# Altium project AtlasRevA.PrjPcb
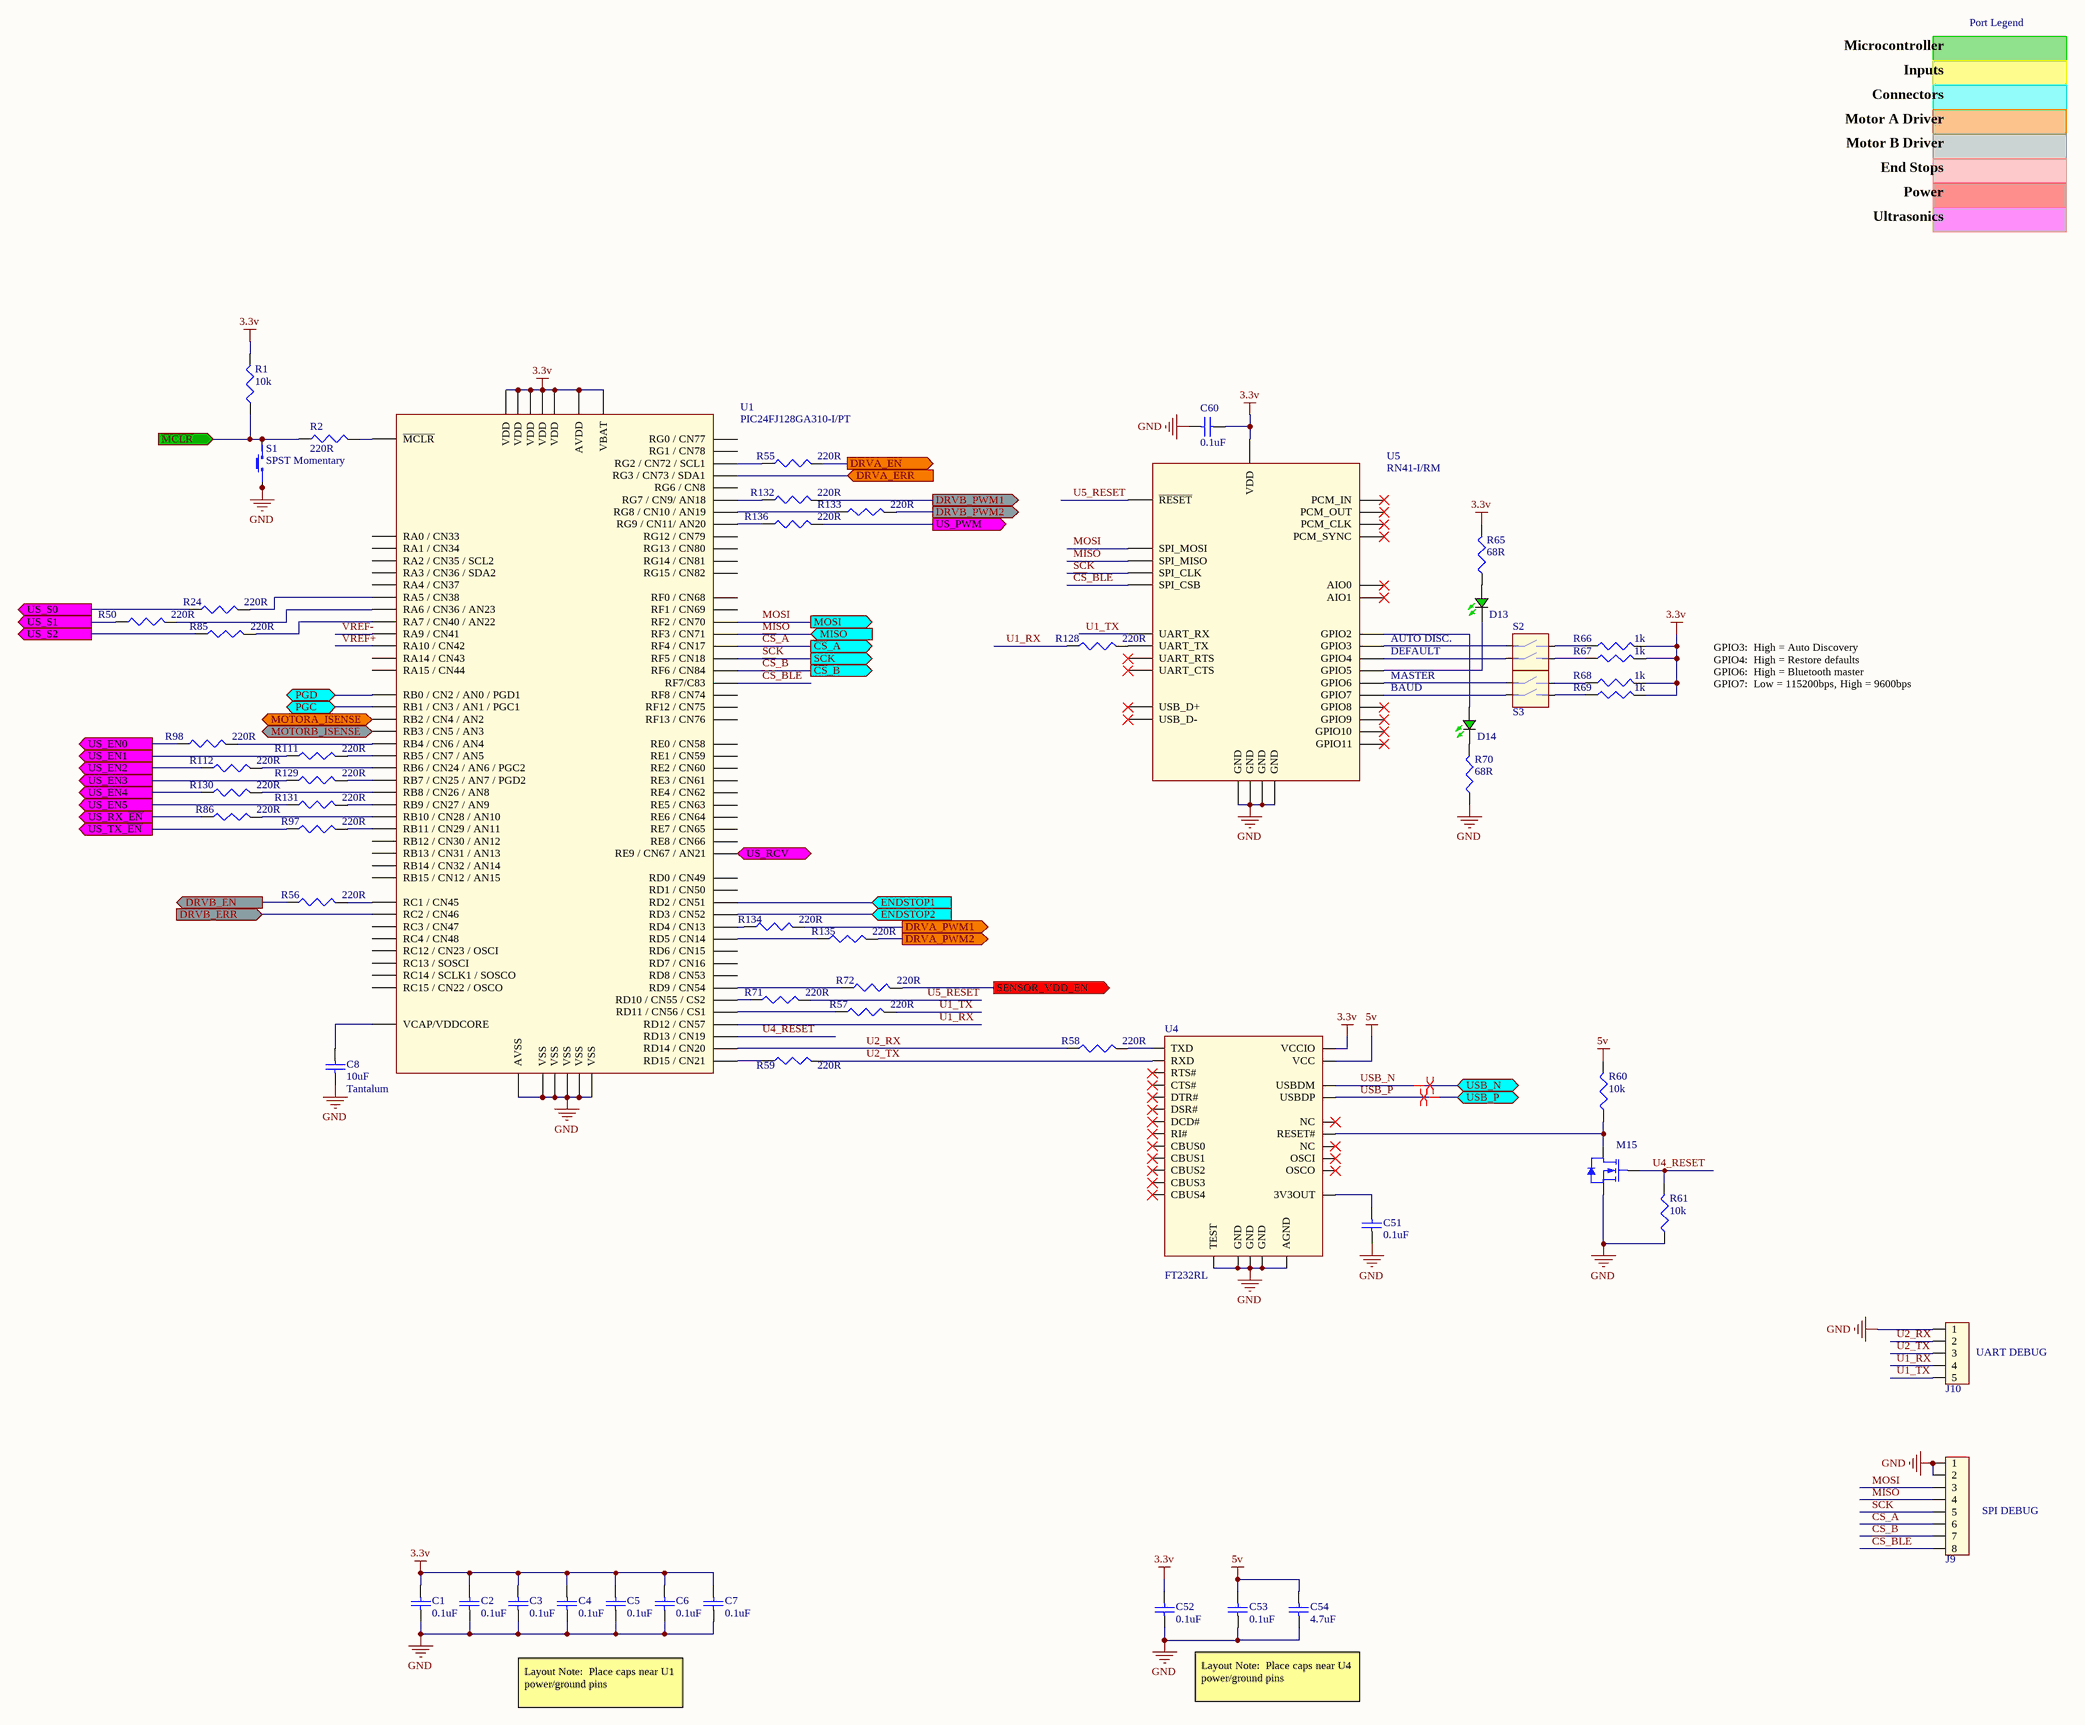
[diagram p0: Microcontroller.SchDoc]
8 sheets, 319 parts. Net scope: flat (ports and power ports of the same name join across sheets).
Board file: AtlasRevA.PcbDoc
Sheets:
  Microcontroller.SchDoc
  Motor A Driver.SchDoc
  Motor B Driver.SchDoc
  Connectors.SchDoc
  End Stops.SchDoc
  Power.SchDoc
  Ultrasonics.SchDoc
  Project Overview.SchDoc

## Sheet Microcontroller.SchDoc
size C; DrawnBy: Ross Harvey; Revision: A; SheetNumber: 1

### Parts
C1  0.1uF  [CAP0603W]
C2  0.1uF  [CAP0603W]
C3  0.1uF  [CAP0603W]
C4  0.1uF  [CAP0603W]
C5  0.1uF  [CAP0603W]
C6  0.1uF  [CAP0603W]
C7  0.1uF  [CAP0603W]
C8  Type: Tantalum  [CAP1206W]  (hidden comment: 10uF)
C51  0.1uF  [CAP0603W]
C52  0.1uF  [CAP0603W]
C53  0.1uF  [CAP0603W]
C54  4.7uF  [CAP1206W]
C60  0.1uF  [CAP0603W]
D13  LTST-S270KGKT  [LED Green 0603]  (value not drawn)
D14  LTST-S270KGKT  [LED Green 0603]  (value not drawn)
J9  1x8 Header  [1x8 Header]  (value not drawn)
J10  1x5 Header  [1x5 Header]  (value not drawn)
M15  2N7002P,215  [SOT23-3M]  (value not drawn)
R1  10k  [RES0603W]
R2  220R  [RES0603W]
R24  220R  [RES0603W]
R50  220R  [RES0603W]
R55  220R  [RES0603W]
R56  220R  [RES0603W]
R57  220R  [RES0603W]
R58  220R  [RES0603W]
R59  220R  [RES0603W]
R60  10k  [RES0603W]
R61  10k  [RES0603W]
R65  68R  [RES0603W]
R66  1k  [RES0603W]
R67  1k  [RES0603W]
R68  1k  [RES0603W]
R69  1k  [RES0603W]
R70  68R  [RES0603W]
R71  220R  [RES0603W]
R72  220R  [RES0603W]
R85  220R  [RES0603W]
R86  220R  [RES0603W]
R97  220R  [RES0603W]
R98  220R  [RES0603W]
R111  220R  [RES0603W]
R112  220R  [RES0603W]
R128  220R  [RES0603W]
R129  220R  [RES0603W]
R130  220R  [RES0603W]
R131  220R  [RES0603W]
R132  220R  [RES0603W]
R133  220R  [RES0603W]
R134  220R  [RES0603W]
R135  220R  [RES0603W]
R136  220R  [RES0603W]
S1  SPST Momentary  [TECONN_1571563]
S2  SPST  [CTS_219-2MST]  (value not drawn)
S3  SPST  [CTS_219-2MST]  (value not drawn)
U1  PIC24FJ128GA310-I/PT  [TQFP100 0.4mm Pitch]
U4  FT232RL  [SSOP-28]
U5  RN41-I/RM  [RN41]

### Ports
DRVA_EN (out), DRVA_ERR (in), DRVA_PWM1 (out), DRVA_PWM2 (out), DRVB_EN (out), DRVB_ERR (in), DRVB_PWM1 (out), DRVB_PWM2 (out), ENDSTOP1 (in), ENDSTOP2 (in), MISO (in), MOSI (out), MOTORA_ISENSE (in), MOTORB_ISENSE (in), PGC (bidir), PGD (bidir), SCK (out), SENSOR_VDD_EN (out), US_EN0 (out), US_EN1 (out), US_EN2 (out), US_EN3 (out), US_EN4 (out), US_EN5 (out), US_PWM (out), US_RCV (in), US_RX_~{EN} (out), US_S0 (out), US_S1 (out), US_S2 (out), US_TX_~{EN} (out), USB_N (bidir), USB_P (bidir), ~{CS}_A (out), ~{CS}_B (out), ~{MCLR} (in)

### Nets
3.3v: C1.1 C2.1 C3.1 C4.1 C5.1 C6.1 C7.1 C52.1 C60.2 R1.2 R65.2 R66.2 R67.2 R68.2 R69.2 U1.2(VDD) U1.16(VDD) U1.30(AVDD) U1.37(VDD) U1.46(VDD) U1.62(VDD) U1.86(VBAT) U4.4(VCCIO) U5.11(VDD)
5v: C53.1 C54.1 R60.2 U4.20(VCC)
GND: C1.2 C2.2 C3.2 C4.2 C5.2 C6.2 C7.2 C8.2 C51.2 C52.2 C53.2 C54.2 C60.1 J9.1 J9.2 J10.1 M15.2(SOURCE) R61.1 R70.1 S1.1 S1.2 U1.15(VSS) U1.31(AVSS) U1.36(VSS) U1.45(VSS) U1.65(VSS) U1.75(VSS) U4.7(GND) U4.18(GND) U4.21(GND) U4.25(AGND) U4.26(TEST) U5.1(GND) U5.12(GND) U5.28(GND) U5.29(GND)
~{CS}_A: J9.6 U1.49(RF4_/_CN17) ; port ~{CS}_A
~{CS}_B: J9.7 U1.55(RF6_/_CN84) ; port ~{CS}_B
~{CS}_BLE: J9.8 U1.54(RF7/C83) U5.23(SPI_CSB)
DRVA_EN: R55.2 ; port DRVA_EN
DRVB_EN: R56.1 ; port DRVB_EN
MISO: J9.4 U1.51(RF3_/_CN71) U5.24(SPI_MISO) ; port MISO
MOSI: J9.3 U1.52(RF2_/_CN70) U5.2(SPI_MOSI) ; port MOSI
SCK: J9.5 U1.50(RF5_/_CN18) U5.6(SPI_CLK) ; port SCK
U1_RX: J10.4 R128.1 U1.79(RD12_/_CN57)
U1_TX: J10.5 R57.2 U5.13(UART_RX)
U2_RX: J10.2 R58.1 U1.47(RD14_/_CN20)
U2_TX: J10.3 R59.2 U4.5(RXD)
U4_RESET: M15.1(GATE) R61.2 U1.80(RD13_/_CN19)
U5_RESET: R71.2 U5.5(~{RESET})
US_S0: R24.1 ; port US_S0
US_S1: R50.1 ; port US_S1
US_S2: R85.1 ; port US_S2
USB_N: U4.16(USBDM) ; port USB_N
USB_P: U4.15(USBDP) ; port USB_P
VREF+: U1.29(RA10_/_CN42)
VREF-: U1.28(RA9_/_CN41)
NetC8_1: C8.1 U1.85(VCAP/VDDCORE)
NetC51_1: C51.1 U4.17(3V3OUT)
NetC56_1: U1.23(RB2_/_CN4_/_AN2) ; port MOTORA_ISENSE
NetC58_1: U1.22(RB3_/_CN5_/_AN3) ; port MOTORB_ISENSE
NetC90_1: U1.77(RD2_/_CN51) ; port ENDSTOP1
NetC92_1: U1.78(RD3_/_CN52) ; port ENDSTOP2
NetD13_1: D13.1(K) U5.21(GPIO5)
NetD13_2: D13.2(A) R65.1
NetD14_1: D14.1(K) R70.2
NetD14_2: D14.2(A) U5.19(GPIO2)
NetJ2_1: R1.1 R2.1 S1.3 S1.4 ; port ~{MCLR}
NetJ2_4: U1.25(RB0_/_CN2_/_AN0_/_PGD1) ; port PGD
NetJ2_5: U1.24(RB1_/_CN3_/_AN1_/_PGC1) ; port PGC
NetM6_3: U1.56(RG3_/_CN73_/_SDA1) ; port DRVA_ERR
NetM13_3: U1.7(RC2_/_CN46) ; port DRVB_ERR
NetM15_3: M15.3(SOURCE) R60.1 U4.19(RESET#)
NetR2_2: R2.2 U1.13(~{MCLR})
NetR24_2: R24.2 U1.61(RA5_/_CN38)
NetR50_2: R50.2 U1.91(RA6_/_CN36_/_AN23)
NetR55_1: R55.1 U1.57(RG2_/_CN72_/_SCL1)
NetR56_2: R56.2 U1.6(RC1_/_CN45)
NetR57_1: R57.1 U1.71(RD11_/_CN56_/_CS1)
NetR58_2: R58.2 U4.1(TXD)
NetR59_1: R59.1 U1.48(RD15_/_CN21)
NetR66_1: R66.1 S2.2
NetR67_1: R67.1 S2.4
NetR68_1: R68.1 S3.2
NetR69_1: R69.1 S3.4
NetR71_1: R71.1 U1.70(RD10_/_CN55_/_CS2)
NetR72_1: R72.1 U1.69(RD9_/_CN54)
NetR72_2: R72.2 ; port SENSOR_VDD_EN
NetR85_2: R85.2 U1.92(RA7_/_CN40_/_AN22)
NetR86_1: R86.1 ; port US_RX_~{EN}
NetR86_2: R86.2 U1.34(RB10_/_CN28_/_AN10)
NetR97_1: R97.1 ; port US_TX_~{EN}
NetR97_2: R97.2 U1.35(RB11_/_CN29_/_AN11)
NetR98_1: R98.1 ; port US_EN0
NetR98_2: R98.2 U1.21(RB4_/_CN6_/_AN4)
NetR111_1: R111.1 ; port US_EN1
NetR111_2: R111.2 U1.20(RB5_/_CN7_/_AN5)
NetR112_1: R112.1 ; port US_EN2
NetR112_2: R112.2 U1.26(RB6_/_CN24_/_AN6_/_PGC2)
NetR128_2: R128.2 U5.14(UART_TX)
NetR129_1: R129.1 ; port US_EN3
NetR129_2: R129.2 U1.27(RB7_/_CN25_/_AN7_/_PGD2)
NetR130_1: R130.1 ; port US_EN4
NetR130_2: R130.2 U1.32(RB8_/_CN26_/_AN8)
NetR131_1: R131.1 ; port US_EN5
NetR131_2: R131.2 U1.33(RB9_/_CN27_/_AN9)
NetR132_1: R132.1 U1.11(RG7_/_CN9/_AN18)
NetR132_2: R132.2 ; port DRVB_PWM1
NetR133_1: R133.1 U1.12(RG8_/_CN10_/_AN19)
NetR133_2: R133.2 ; port DRVB_PWM2
NetR134_1: R134.1 U1.81(RD4_/_CN13)
NetR134_2: R134.2 ; port DRVA_PWM1
NetR135_1: R135.1 U1.82(RD5_/_CN14)
NetR135_2: R135.2 ; port DRVA_PWM2
NetR136_1: R136.1 U1.14(RG9_/_CN11/_AN20)
NetR136_2: R136.2 ; port US_PWM
NetS2_1: S2.1 U5.20(GPIO3)
NetS2_3: S2.3 U5.22(GPIO4)
NetS3_1: S3.1 U5.3(GPIO6)
NetS3_3: S3.3 U5.4(GPIO7)
NetU1_19: U1.19(RE9_/_CN67_/_AN21) ; port US_RCV

Not connected (* = marked no-connect by the designer): U1 1(RG15_/_CN82) 3(RE5_/_CN63) 4(RE6_/_CN64) 5(RE7_/_CN65) 8(RC3_/_CN47) 9(RC4_/_CN48) 10(RG6_/_CN8) 17(RA0_/_CN33) 18(RE8_/_CN66) 38(RA1_/_CN34) 39(RF13_/_CN76) 40(RF12_/_CN75) 41(RB12_/_CN30_/_AN12) 42(RB13_/_CN31_/_AN13) 43(RB14_/_CN32_/_AN14) 44(RB15_/_CN12_/_AN15) 53(RF8_/_CN74) 58(RA2_/_CN35_/_SCL2) 59(RA3_/_CN36_/_SDA2) 60(RA4_/_CN37) 63(RC12_/_CN23_/_OSCI) 64(RC15_/_CN22_/_OSCO) 66(RA14_/_CN43) 67(RA15_/_CN44) 68(RD8_/_CN53) 72(RD0_/_CN49) 73(RC13_/_SOSCI) 74(RC14_/_SCLK1_/_SOSCO) 76(RD1_/_CN50) 83(RD6_/_CN15) 84(RD7_/_CN16) 87(RF0_/_CN68) 88(RF1_/_CN69) 89(RG1_/_CN78) 90(RG0_/_CN77) 93(RE0_/_CN58) 94(RE1_/_CN59) 95(RG14_/_CN81) 96(RG12_/_CN79) 97(RG13_/_CN80) 98(RE2_/_CN60) 99(RE3_/_CN61) 100(RE4_/_CN62); U4 2(DTR#)* 3(RTS#)* 6(RI#)* 8(NC)* 9(DSR#)* 10(DCD#)* 11(CTS#)* 12(CBUS4)* 13(CBUS2)* 14(CBUS3)* 22(CBUS1)* 23(CBUS0)* 24(NC)* 27(OSCI)* 28(OSCO)*; U5 7(PCM_CLK)* 8(PCM_SYNC)* 9(PCM_IN)* 10(PCM_OUT)* 15(UART_RTS)* 16(UART_CTS)* 17(USB_D+)* 18(USB_D-)* 30(AIO0)* 31(GPIO8)* 32(GPIO9)* 33(GPIO10)* 34(GPIO11)* 35(AIO1)*

### Layout directives
differential pair: USB_N, USB_P

### Notes on the sheet
- Port Legend
- Microcontroller
- Inputs
- Connectors
- Motor A Driver
- Motor B Driver
- End Stops
- Power
- Ultrasonics
- AUTO DISC.
- (near U5) DEFAULT
- (near U5) BAUD
- (near U5) MASTER
- GPIO3:  High = Auto Discovery
  GPIO4:  High = Restore defaults
  GPIO6:  High = Bluetooth master
  GPIO7:  Low = 115200bps, High = 9600bps
- (near J10) UART DEBUG
- (near J9) SPI DEBUG
- Layout Note:  Place caps near U4 power/ground pins
- Layout Note:  Place caps near U1 power/ground pins

### Library data of the parts
C1-C7 C51-C53 C60 = 0.1uF: MFG1_PN: VJ0603Y104JXJPW1BC; MFG1: Vishay; Value: 0.1uF
C8 = 10uF Tantalum: MFG1_PN: 293D106X96R3A2TE3; MFG1: Vishay; Value: 10uF
C54 = 4.7uF: MFG1_PN: VJ1206V475ZXJTW1BC; MFG1: Vishay; Voltage: 16v; Value: 4.7uF
D13 D14 = LED Green 0603: MFG: Lite On; VFORWARD: 2v; CURRENT: 20mA; COLOR: Green; MFG_PN: LTST-S270KGKT
J9 = 1x8 Header: 1x8 Header, 2.52mm pitch
J10 = 1x5 Header: 1x5 Header, 2.52mm pitch
M15 = 2N7002: NFET_SINGLE_360mA_60V; LOAD: NL; MFG: NXP; VDS_MAX: 60v; I_MAX: 360mA; VGS_MAX: 20v; P_MAX: *; RDS_ON: *; MFG_PN: 2N7002P,215
R1 R60 R61 = 10K (0603): Tolerance: 1%; POWER: 0.1W; MFG_PN: CRCW060310K0FKEA; MFG: Vishay; Load: NL; Value: 10k
R2 R24 R50 R55-R59 R71 R72 R85 R86 R97 R98 R111 R112 R128-R136 = 220R (0603): Tolerance: 1%; POWER: 0.1W; MFG_PN: CRCW0603220RFKEB; MFG: Vishay; Load: NL; Value: 220R
R65 R70 = 68R (0603): Tolerance: 1%; POWER: 0.1W; MFG_PN: CRCW060368R0FKEB; MFG: Vishay; Load: NL; Value: 68R
R66-R69 = 1k (0603): Tolerance: 1%; POWER: 0.1W; MFG_PN: CRCW06031K00FKEA; MFG: Vishay; Load: NL; Value: 1k
S1 = SPST Momentary: SPST Momentary Switch; MFG: TE Connectivity; MFG_PN: 1571563-1; TYPE: SPST Momentary
S2 S3 = 2xSPST Microswitch: SPST Microswitch Array (2 Switches); MFG: CTS; MFG_PN: 219-2MST; TYPE: SPST
U1 = PIC24FJ128GA310: MFG: Microchip; MFG_PN: PIC24FJ128GA310-I/PT
U4 = FT232RL: UART Interface/Bridge; MFG: FTDI; MFG_PN: FT232RL
U5 = RN41: 2.4GHz Class 1 Bluetooth Module; MFG: MICROCHIP; MFG_PN: RN41-I/RM

## Sheet Motor A Driver.SchDoc
size C; DrawnBy: Ross Harvey; Revision: A; SheetNumber: 2; ModifiedDate: 7/2/2015
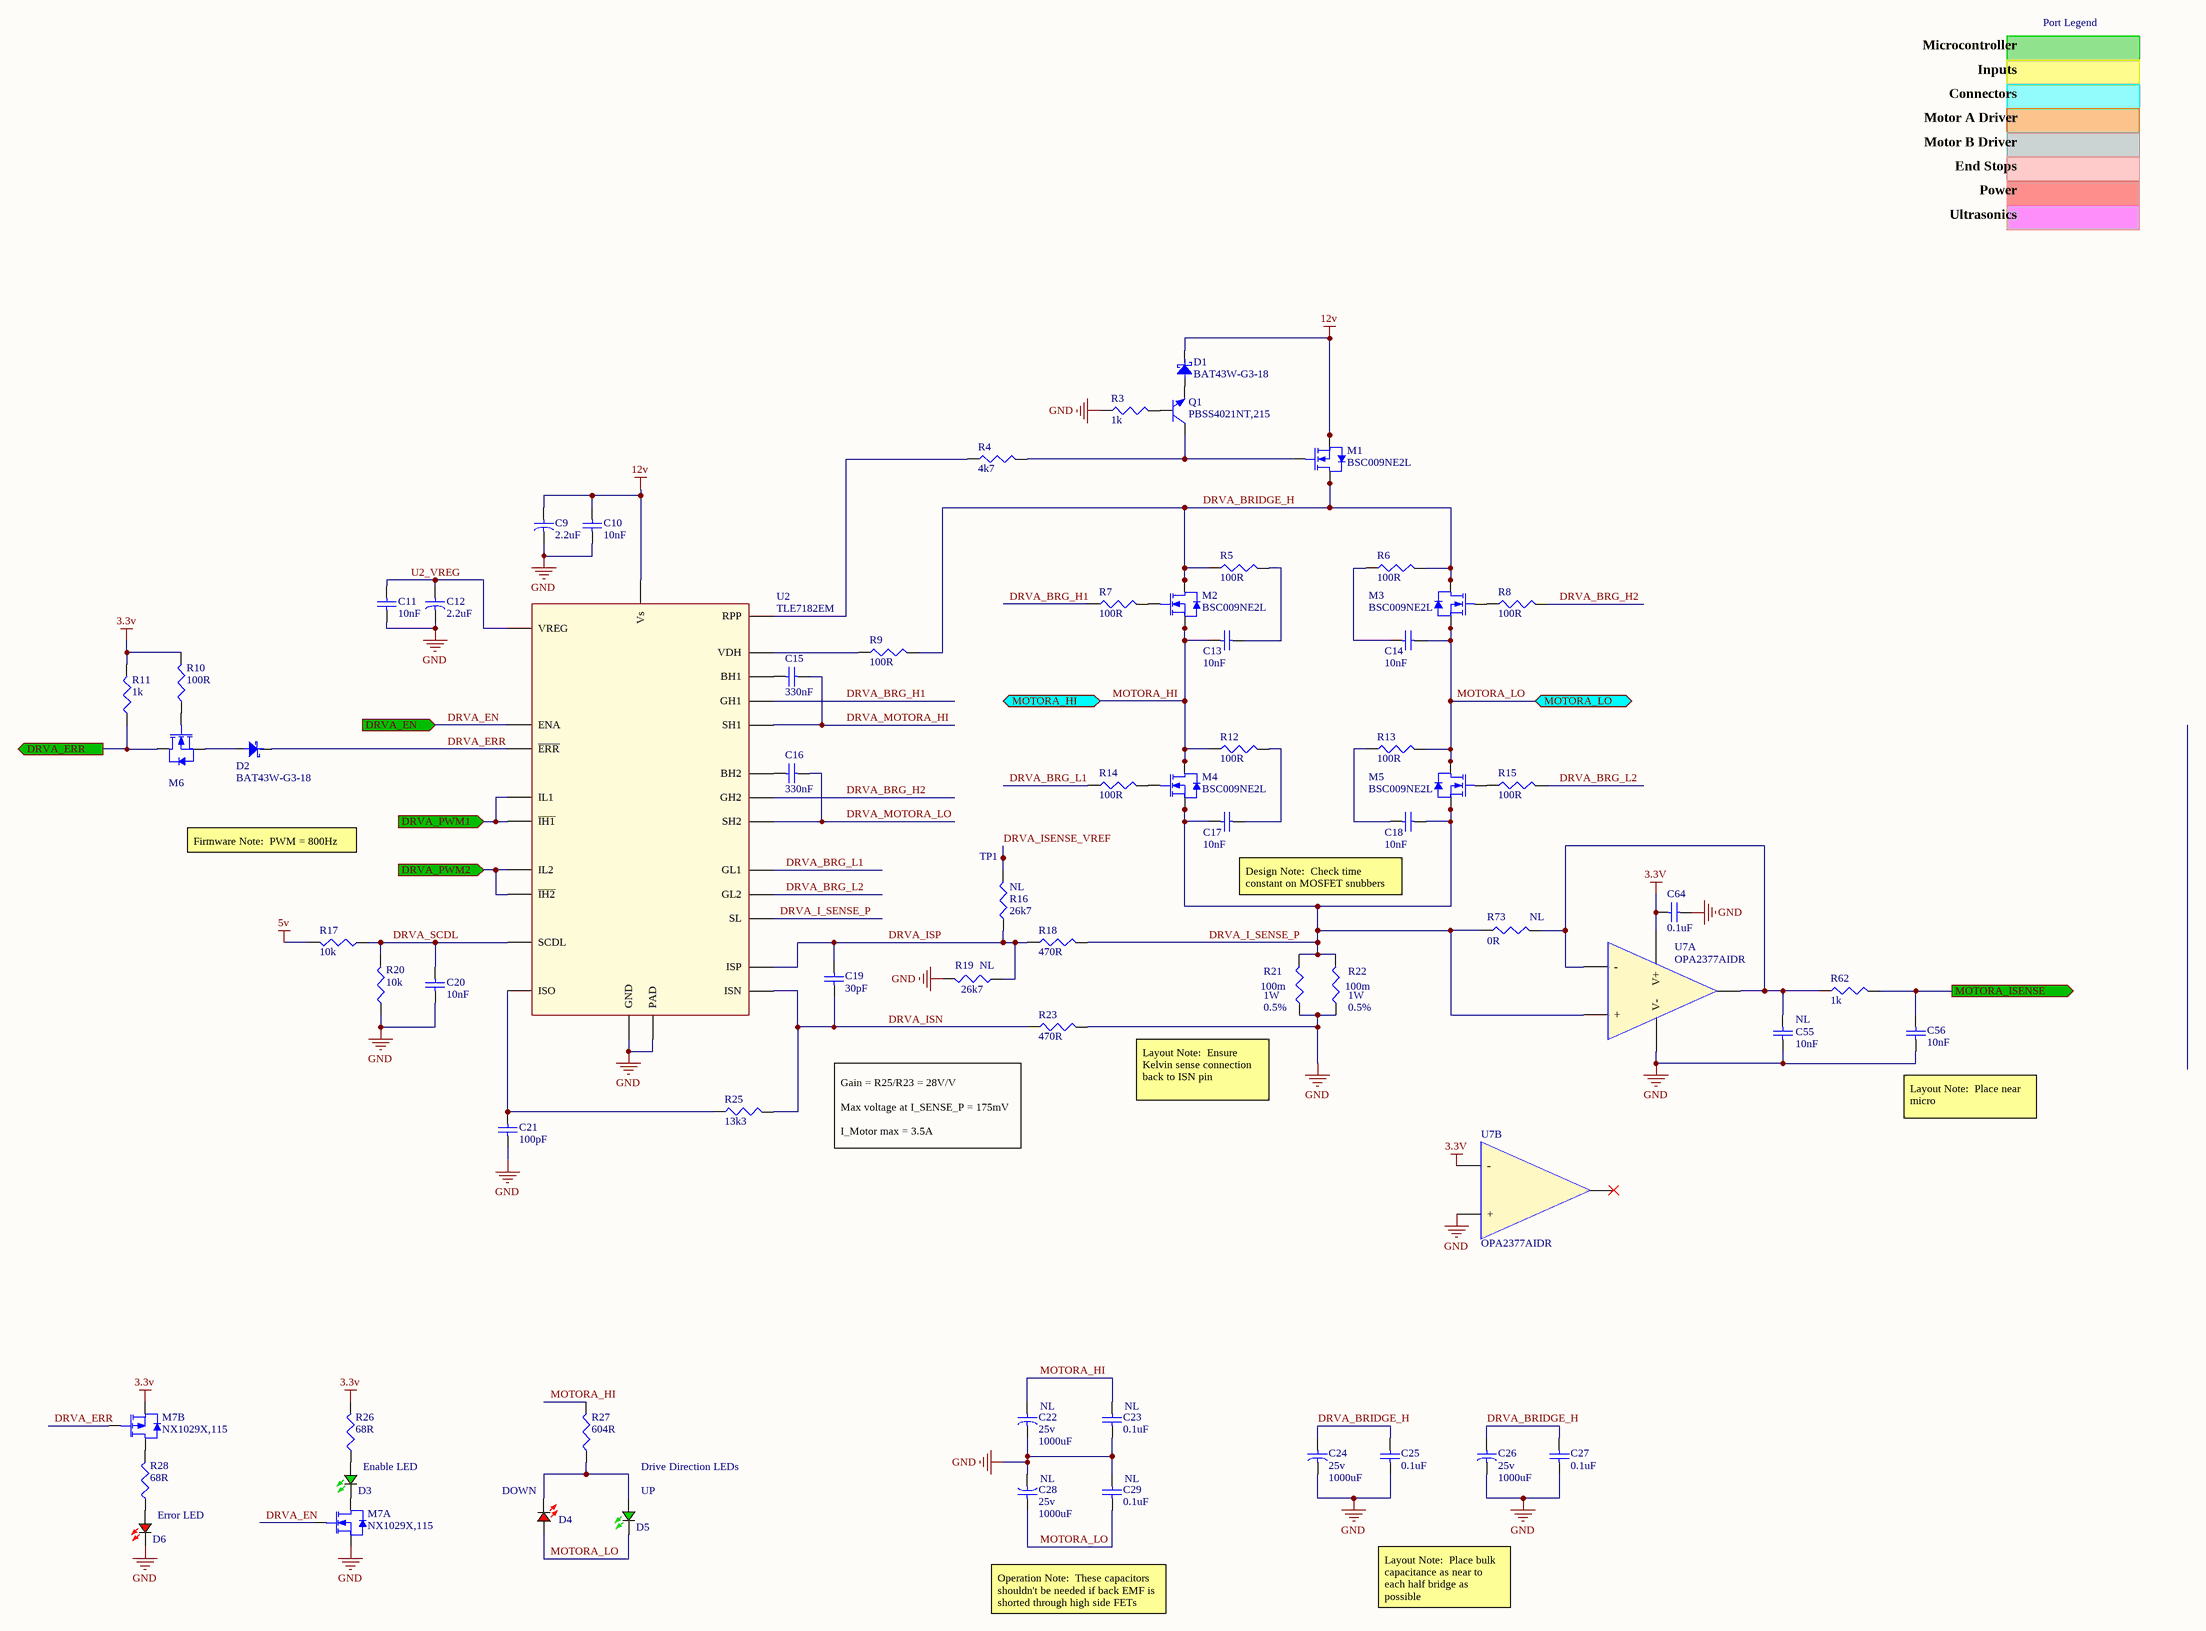
[diagram p1: Motor A Driver.SchDoc]

### Parts
C9  2.2uF  [SMD Elec Cap (5.5_5.4_4)]
C10  10nF  [CAP0603W]
C11  10nF  [CAP0603W]
C12  2.2uF  [SMD Elec Cap (5.5_5.4_4)]
C13  10nF  [CAP0603W]
C14  10nF  [CAP0603W]
C15  330nF  [CAP0805W]
C16  330nF  [CAP0805W]
C17  10nF  [CAP0603W]
C18  10nF  [CAP0603W]
C19  30pF  [CAP0603W]
C20  10nF  [CAP0603W]
C21  100pF  [CAP0603W]
C22  Voltage: 25v  LOAD: NL  [SMD Elec Cap (13.5_15_12.5)]  (hidden comment: 1000uF)
C23  LOAD: NL  [CAP0603W]  (hidden comment: 0.1uF)
C24  Voltage: 25v  [SMD Elec Cap (13.5_15_12.5)]  (hidden comment: 1000uF)
C25  0.1uF  [CAP0603W]
C26  Voltage: 25v  [SMD Elec Cap (13.5_15_12.5)]  (hidden comment: 1000uF)
C27  0.1uF  [CAP0603W]
C28  Voltage: 25v  LOAD: NL  [SMD Elec Cap (13.5_15_12.5)]  (hidden comment: 1000uF)
C29  LOAD: NL  [CAP0603W]  (hidden comment: 0.1uF)
C55  LOAD: NL  [CAP0603W]  (hidden comment: 10nF)
C56  10nF  [CAP0603W]
C64  0.1uF  [CAP0603W]
D1  BAT43W-G3-18  [SOD-123]
D2  BAT43W-G3-18  [SOD-123]
D3  LTST-S270KGKT  [LED Green 0603]  (value not drawn)
D4  VLMS1300-GS08  [LED Red 0603]  (value not drawn)
D5  LTST-S270KGKT  [LED Green 0603]  (value not drawn)
D6  VLMS1300-GS08  [LED Red 0603]  (value not drawn)
M1  BSC009NE2L  [PowerPAK-SO8]
M2  BSC009NE2L  [PowerPAK-SO8]
M3  BSC009NE2L  [PowerPAK-SO8]
M4  BSC009NE2L  [PowerPAK-SO8]
M5  BSC009NE2L  [PowerPAK-SO8]
M6  2N7002P,215  [SOT23-3M]  (value not drawn)
M7  NX1029X,115  [SOT666-6N]  (parts A,B of 2)
Q1  PBSS4021NT,215  [SOT23-3M]
R3  1k  [RES0603W]
R4  4k7  [RES0603W]
R5  100R  [RES0603W]
R6  100R  [RES0603W]
R7  100R  [RES0603W]
R8  100R  [RES0603W]
R9  100R  [RES0603W]
R10  100R  [RES0603W]
R11  1k  [RES0603W]
R12  100R  [RES0603W]
R13  100R  [RES0603W]
R14  100R  [RES0603W]
R15  100R  [RES0603W]
R16  Load: NL  [RES0603W]  (hidden comment: 26k7)
R17  10k  [RES0603W]
R18  470R  [RES0603W]
R19  Load: NL  [RES0603W]  (hidden comment: 26k7)
R20  10k  [RES0603W]
R21  POWER: 1W  Tolerance: 0.5%  [RES2512W]  (hidden comment: 100m)
R22  POWER: 1W  Tolerance: 0.5%  [RES2512W]  (hidden comment: 100m)
R23  470R  [RES0603W]
R25  13k3  [RES0603W]
R26  68R  [RES0603W]
R27  604R  [RES1206W]
R28  68R  [RES0603W]
R62  1k  [RES0603W]
R73  Load: NL  [RES0603W]  (hidden comment: 0R)
TP1  TP  [1mm Via]  (value not drawn)
U2  TLE7182EM  [PG-SSOP24]
U7  OPA2377AIDR  [SOIC-8]  (parts A,B of 2)

### Ports
DRVA_EN (in), DRVA_ERR (out), DRVA_PWM1 (in), DRVA_PWM2 (in), MOTORA_HI (bidir), MOTORA_ISENSE (out), MOTORA_LO (bidir)

### Nets
3.3v: C64.1 M7.4(S2) R10.2 R11.2 R26.2 U7.6(-) U7.8(V+)
5v: R17.2
12v: C9.2 C10.1 D1.1(K) M1.1(SOURCE) M1.2(SOURCE) M1.3(SOURCE) U2.7(Vs)
GND: C9.1 C10.2 C11.2 C12.1 C20.2 C21.2 C22.1 C23.2 C24.1 C25.2 C26.1 C27.2 C28.1 C29.1 C55.2 C56.2 C64.2 D6.1(K) M7.1(S1) R3.1 R19.2 R20.1 R21.1 R22.1 R23.2 U2.19(GND) U2.25(PAD) U7.4(V-) U7.5(+)
DRVA_BRG_H1: R7.1 U2.23(GH1)
DRVA_BRG_H2: R8.2 U2.2(GH2)
DRVA_BRG_L1: R14.1 U2.21(GL1)
DRVA_BRG_L2: R15.2 U2.4(GL2)
DRVA_BRIDGE_H: C24.2 C25.1 C26.2 C27.1 M1.5(DRAIN) M1.6(DRAIN) M1.7(DRAIN) M1.8(DRAIN) M2.5(DRAIN) M2.6(DRAIN) M2.7(DRAIN) M2.8(DRAIN) M3.5(DRAIN) M3.6(DRAIN) M3.7(DRAIN) M3.8(DRAIN) R5.1 R6.2 R9.2
DRVA_EN: M7.2(G1) U2.9(ENA) ; port DRVA_EN
DRVA_ERR: D2.1(K) M7.5(G2) U2.17(~{ERR})
DRVA_I_SENSE_P: C17.1 C18.2 M4.1(SOURCE) M4.2(SOURCE) M4.3(SOURCE) M5.1(SOURCE) M5.2(SOURCE) M5.3(SOURCE) R18.2 R21.2 R22.2 R73.1 U2.20(SL) U7.3(+)
DRVA_ISENSE_VREF: R16.2 TP1.1
DRVA_ISN: C19.2 R23.1 R25.2 U2.10(ISN)
DRVA_ISP: C19.1 R16.1 R18.1 R19.1 U2.11(ISP)
DRVA_MOTORA_HI: C15.2 U2.22(SH1)
DRVA_MOTORA_LO: C16.2 U2.3(SH2)
DRVA_SCDL: C20.1 R17.1 R20.2 U2.18(SCDL)
MOTORA_HI: C13.1 C22.2 C23.1 M2.1(SOURCE) M2.2(SOURCE) M2.3(SOURCE) M4.5(DRAIN) M4.6(DRAIN) M4.7(DRAIN) M4.8(DRAIN) R12.1 R27.2 ; port MOTORA_HI
MOTORA_LO: C14.2 C28.2 C29.2 D4.2(A) D5.1(K) M3.1(SOURCE) M3.2(SOURCE) M3.3(SOURCE) M5.5(DRAIN) M5.6(DRAIN) M5.7(DRAIN) M5.8(DRAIN) R13.2 ; port MOTORA_LO
U2_VREG: C11.1 C12.2 U2.8(VREG)
NetC13_2: C13.2 R5.2
NetC14_1: C14.1 R6.1
NetC15_1: C15.1 U2.24(BH1)
NetC16_1: C16.1 U2.1(BH2)
NetC17_2: C17.2 R12.2
NetC18_1: C18.1 R13.1
NetC21_1: C21.1 R25.1 U2.12(ISO)
NetC55_1: C55.1 R62.1 R73.2 U7.1(OUTA) U7.2(-)
NetC56_1: C56.1 R62.2 ; port MOTORA_ISENSE
NetD1_2: D1.2(A) Q1.2(C)
NetD2_2: D2.2(A) M6.2(SOURCE)
NetD3_1: D3.1(K) M7.6(D1)
NetD3_2: D3.2(A) R26.1
NetD4_1: D4.1(K) D5.2(A) R27.1
NetD6_2: D6.2(A) R28.1
NetM1_4: M1.4(GATE) Q1.3(E) R4.2
NetM2_4: M2.4(GATE) R7.2
NetM3_4: M3.4(GATE) R8.1
NetM4_4: M4.4(GATE) R14.2
NetM5_4: M5.4(GATE) R15.1
NetM6_1: M6.1(GATE) R10.1
NetM6_3: M6.3(SOURCE) R11.1 ; port DRVA_ERR
NetM7_3: M7.3(D2) R28.2
NetQ1_1: Q1.1(B) R3.2
NetR4_1: R4.1 U2.6(RPP)
NetR9_1: R9.1 U2.5(VDH)
NetR134_2: U2.15(~{IH1}) U2.16(IL1) ; port DRVA_PWM1
NetR135_2: U2.13(~{IH2}) U2.14(IL2) ; port DRVA_PWM2

Not connected (* = marked no-connect by the designer): U7 7(OUTB)*

### Notes on the sheet
- Microcontroller
- Port Legend
- Inputs
- Connectors
- Motor A Driver
- Motor B Driver
- End Stops
- Power
- Ultrasonics
- Firmware Note:  PWM = 800Hz
- Design Note:  Check time constant on MOSFET snubbers
- (near R23) Gain = R25/R23 = 28V/V
  Max voltage at I_SENSE_P = 175mV
  I_Motor max = 3.5A
- Layout Note:  Ensure Kelvin sense connection back to ISN pin
- (near C56) Layout Note:  Place near micro
- Enable LED
- (near D4) DOWN
- Drive Direction LEDs
- (near D5) UP
- Error LED
- Operation Note:  These capacitors shouldn't be needed if back EMF is shorted through high side FETs
- Layout Note:  Place bulk capacitance as near to each half bridge as possible

### Library data of the parts
C9 C12 = 2.2uF/35v: Tolerance: 20%; MFG1_PN: EEE-FC1V2R2AR; MFG1: PANASONIC; Voltage: 35v; Value: 2.2uF
C10 C11 C13 C14 C17 C18 C20 C55 C56 = 10nF: MFG1_PN: VJ0603Y103KXAAC; MFG1: Vishay; Value: 10nF
C15 C16 = 330nF: MFG1_PN: VJ0805V334ZXAPW1BC; MFG1: Vishay; Voltage: 50v; Value: 330nF
C19 = 30pF: MFG1_PN: VJ0805A300JXBAT; MFG1: Vishay; Value: 30pF
C21 = 100pF: MFG1_PN: VJ0603A101JNAAO; MFG1: Vishay; Voltage: 50v; Value: 100pF
C22 C24 C26 C28 = 1000uF 25v: Tolerance: 20%; MFG1_PN: EEV-FK1E102Q; MFG1: PANASONIC; Value: 1000uF
C23 C25 C27 C29 C64 = 0.1uF: as C1 on sheet Microcontroller; Value: 0.1uF
D1 D2 = BAT43: MFG: Vishay; Value: *; MFG_PN: BAT43W-G3-18
D3 D5 = LED Green 0603: as D13 on sheet Microcontroller; MFG_PN: LTST-S270KGKT
D4 D6 = LED Red 0603: MFG: Vishay; VFORWARD: 2V; CURRENT: 20mA; COLOR: Red; MFG_PN: VLMS1300-GS08
M1-M5 = BSC009NE2L: NFET_SINGLE_100A_25v; LOAD: NL; MFG: INFINEON; VDS_MAX: 25v; I_MAX: 100A; VGS_MAX: 16; P_MAX: 74W; RDS_ON: 1.25m; MFG_PN: BSC009NE2LS5ATMA1
M6 = 2N7002: as M15 on sheet Microcontroller; P_MAX: *; RDS_ON: *; MFG_PN: 2N7002P,215
M7 = NX1029X: Complementary P/NFET; MFG: NXP; VDS_P: -50v; VDS_N: 60v; VGS: 20v; ID_P: -170mA; ID_N: 330mA; MFG_PN: NX1029X,115
Q1 = PBSS4021NT: NPN_SINGLE_8A_20v; MFG: NXP; VCE_MAX: 20v; IMAX: 8A; LOAD: NL; MFG_PN: PBSS4021NT,215
R3 R11 R62 = 1k (0603): as R66 on sheet Microcontroller; Value: 1k
R4 = 4k7 (0603): Tolerance: 1%; POWER: 0.1W; MFG_PN: CRCW06034K70FKEA; MFG: Vishay; Load: NL; Value: 4k7
R5-R10 R12-R15 = 100R (0603): Tolerance: 1%; POWER: 0.1W; MFG_PN: CRCW0603100RFKEA; MFG: Vishay; Load: NL; Value: 100R
R16 R19 = 26k7 (0603): Tolerance: 1%; POWER: 0.1W; MFG_PN: CRCW060326K7FKEA; MFG: Vishay; Value: 26k7
R17 R20 = 10K (0603): as R1 on sheet Microcontroller; Value: 10k
R18 R23 = 470R (0603): Tolerance: 1%; POWER: 0.1W; MFG_PN: CRCW0603470RFKEA; MFG: Vishay; Load: NL; Value: 470R
R21 R22 = 100mR 0.5% (2512): MFG_PN: WSL2512R1000DEA; MFG: Vishay; Load: NL; Value: 100m
R25 = 13k3 (0603): Tolerance: 1%; POWER: 0.1W; MFG_PN: CRCW060313K3FKEA; MFG: Vishay; Load: NL; Value: 13k3
R26 R28 = 68R (0603): as R65 on sheet Microcontroller; Value: 68R
R27 = 604R (1206): POWER: 0.5W; MFG_PN: CRCW1206604RFKEAHP; MFG: VISHAY; Load: NL; Tolerance: 1%; Value: 604R
R73 = 0R (0603): MFG_PN: CRCW12060000Z0EA; MFG: Vishay; Value: 0R
TP1 = Testpoint - Via 1mm
U2 = TLE7182: Full Bridge Gate Driver; MFG: INFINEON; LOAD: NL; MFG_PN: TLE7182EM
U7 = OPA2377AIDR: OpAmp - 2 Channel; LOAD: NL; MFG: TI; CHANNELS: 2; GBP: 5MHz; SINGLE_SUPPLY: TRUE; VMAX: 5.5v; OFFSET_VOLTAGE: 1mV; MFG_PN: OPA2377AIDR

## Sheet Motor B Driver.SchDoc
size C; DrawnBy: Ross Harvey; Revision: A; SheetNumber: 3; DocumentName: Motor B Driver; ModifiedDate: 7/2/2105; ProjectName: Atlas
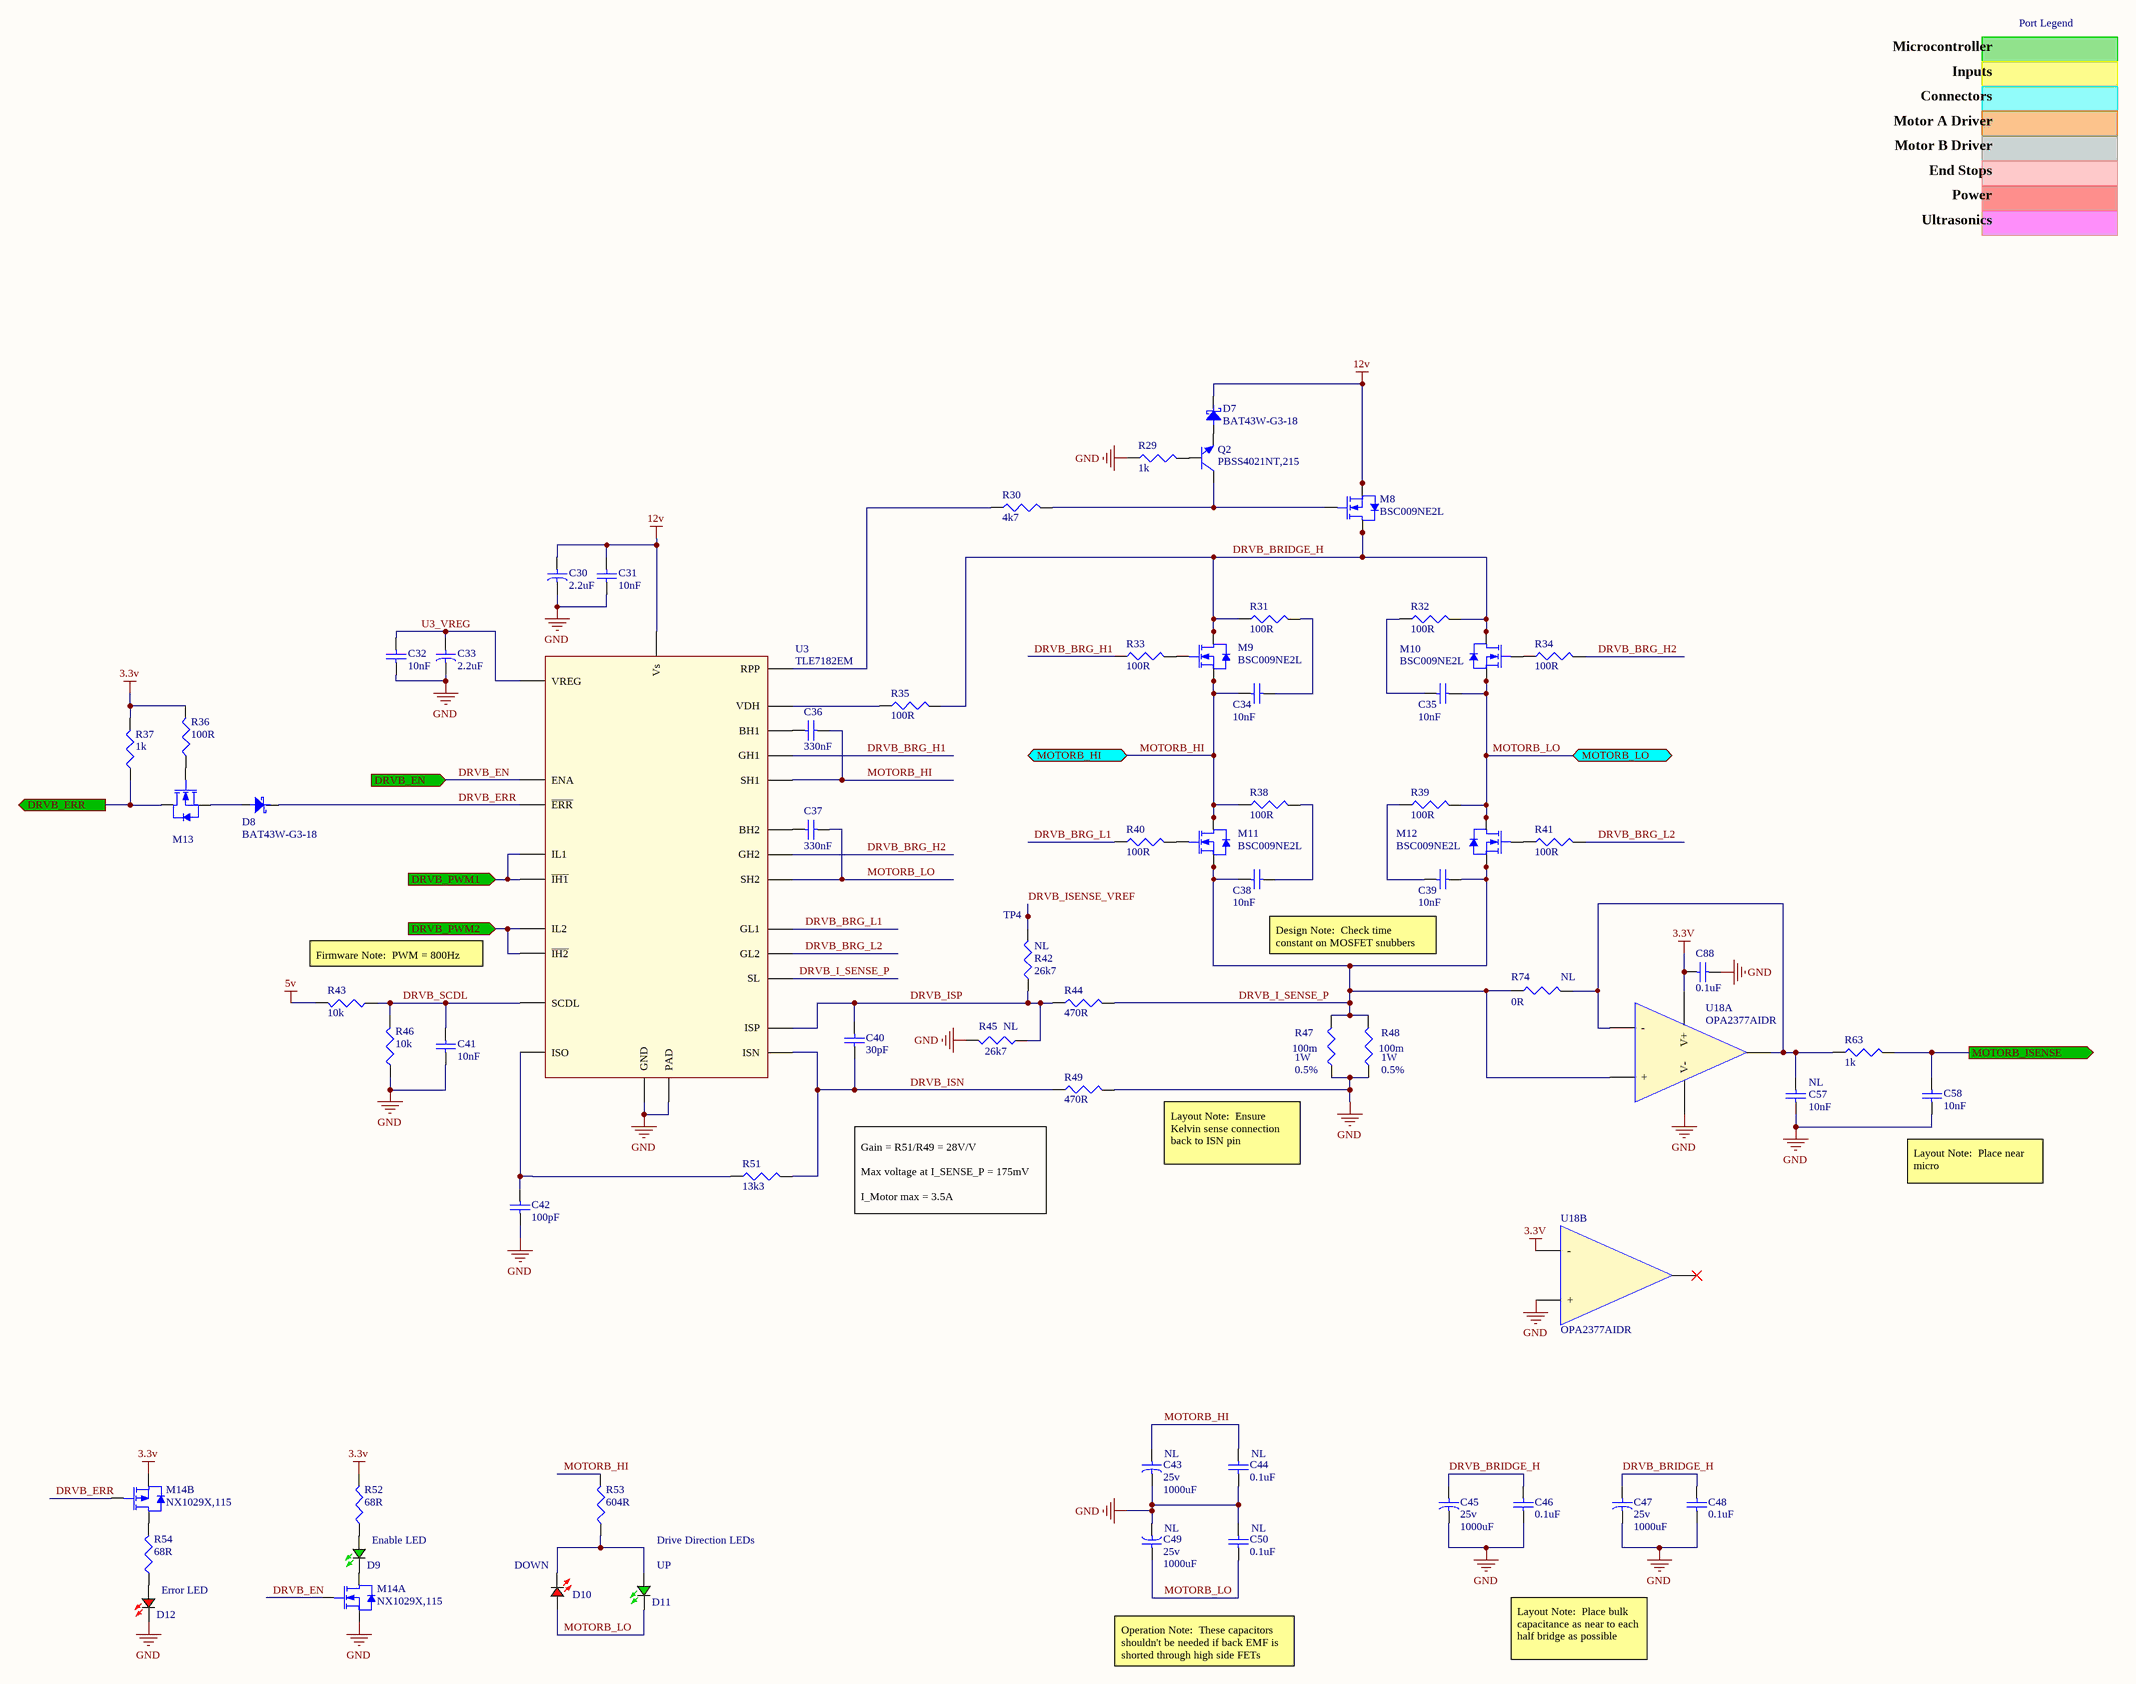
[diagram p2: Motor B Driver.SchDoc]

### Parts
C30  2.2uF  [SMD Elec Cap (5.5_5.4_4)]
C31  10nF  [CAP0603W]
C32  10nF  [CAP0603W]
C33  2.2uF  [SMD Elec Cap (5.5_5.4_4)]
C34  10nF  [CAP0603W]
C35  10nF  [CAP0603W]
C36  330nF  [CAP0805W]
C37  330nF  [CAP0805W]
C38  10nF  [CAP0603W]
C39  10nF  [CAP0603W]
C40  30pF  [CAP0603W]
C41  10nF  [CAP0603W]
C42  100pF  [CAP0603W]
C43  Voltage: 25v  LOAD: NL  [SMD Elec Cap (13.5_15_12.5)]  (hidden comment: 1000uF)
C44  LOAD: NL  [CAP0603W]  (hidden comment: 0.1uF)
C45  Voltage: 25v  [SMD Elec Cap (13.5_15_12.5)]  (hidden comment: 1000uF)
C46  0.1uF  [CAP0603W]
C47  Voltage: 25v  [SMD Elec Cap (13.5_15_12.5)]  (hidden comment: 1000uF)
C48  0.1uF  [CAP0603W]
C49  Voltage: 25v  LOAD: NL  [SMD Elec Cap (13.5_15_12.5)]  (hidden comment: 1000uF)
C50  LOAD: NL  [CAP0603W]  (hidden comment: 0.1uF)
C57  LOAD: NL  [CAP0603W]  (hidden comment: 10nF)
C58  10nF  [CAP0603W]
C88  0.1uF  [CAP0603W]
D7  BAT43W-G3-18  [SOD-123]
D8  BAT43W-G3-18  [SOD-123]
D9  LTST-S270KGKT  [LED Green 0603]  (value not drawn)
D10  VLMS1300-GS08  [LED Red 0603]  (value not drawn)
D11  LTST-S270KGKT  [LED Green 0603]  (value not drawn)
D12  VLMS1300-GS08  [LED Red 0603]  (value not drawn)
M8  BSC009NE2L  [PowerPAK-SO8]
M9  BSC009NE2L  [PowerPAK-SO8]
M10  BSC009NE2L  [PowerPAK-SO8]
M11  BSC009NE2L  [PowerPAK-SO8]
M12  BSC009NE2L  [PowerPAK-SO8]
M13  2N7002P,215  [SOT23-3M]  (value not drawn)
M14  NX1029X,115  [SOT666-6N]  (parts A,B of 2)
Q2  PBSS4021NT,215  [SOT23-3M]
R29  1k  [RES0603W]
R30  4k7  [RES0603W]
R31  100R  [RES0603W]
R32  100R  [RES0603W]
R33  100R  [RES0603W]
R34  100R  [RES0603W]
R35  100R  [RES0603W]
R36  100R  [RES0603W]
R37  1k  [RES0603W]
R38  100R  [RES0603W]
R39  100R  [RES0603W]
R40  100R  [RES0603W]
R41  100R  [RES0603W]
R42  Load: NL  [RES0603W]  (hidden comment: 26k7)
R43  10k  [RES0603W]
R44  470R  [RES0603W]
R45  Load: NL  [RES0603W]  (hidden comment: 26k7)
R46  10k  [RES0603W]
R47  POWER: 1W  Tolerance: 0.5%  [RES2512W]  (hidden comment: 100m)
R48  POWER: 1W  Tolerance: 0.5%  [RES2512W]  (hidden comment: 100m)
R49  470R  [RES0603W]
R51  13k3  [RES0603W]
R52  68R  [RES0603W]
R53  604R  [RES1206W]
R54  68R  [RES0603W]
R63  1k  [RES0603W]
R74  Load: NL  [RES0603W]  (hidden comment: 0R)
TP4  TP  [1mm Via]  (value not drawn)
U3  TLE7182EM  [PG-SSOP24]
U18  OPA2377AIDR  [SOIC-8]  (parts A,B of 2)

### Ports
DRVB_EN (in), DRVB_ERR (out), DRVB_PWM1 (in), DRVB_PWM2 (in), MOTORB_HI (bidir), MOTORB_ISENSE (out), MOTORB_LO (bidir)

### Nets
3.3v: C88.1 M14.4(S2) R36.2 R37.2 R52.2 U18.6(-) U18.8(V+)
5v: R43.2
12v: C30.2 C31.1 D7.1(K) M8.1(SOURCE) M8.2(SOURCE) M8.3(SOURCE) U3.7(Vs)
GND: C30.1 C31.2 C32.2 C33.1 C41.2 C42.2 C43.1 C44.2 C45.1 C46.2 C47.1 C48.2 C49.1 C50.1 C57.2 C58.2 C88.2 D12.1(K) M14.1(S1) R29.1 R45.2 R46.1 R47.1 R48.1 R49.2 U3.19(GND) U3.25(PAD) U18.4(V-) U18.5(+)
DRVB_BRG_H1: R33.1 U3.23(GH1)
DRVB_BRG_H2: R34.2 U3.2(GH2)
DRVB_BRG_L1: R40.1 U3.21(GL1)
DRVB_BRG_L2: R41.2 U3.4(GL2)
DRVB_BRIDGE_H: C45.2 C46.1 C47.2 C48.1 M8.5(DRAIN) M8.6(DRAIN) M8.7(DRAIN) M8.8(DRAIN) M9.5(DRAIN) M9.6(DRAIN) M9.7(DRAIN) M9.8(DRAIN) M10.5(DRAIN) M10.6(DRAIN) M10.7(DRAIN) M10.8(DRAIN) R31.1 R32.2 R35.2
DRVB_EN: M14.2(G1) U3.9(ENA) ; port DRVB_EN
DRVB_ERR: D8.1(K) M14.5(G2) U3.17(~{ERR})
DRVB_I_SENSE_P: C38.1 C39.2 M11.1(SOURCE) M11.2(SOURCE) M11.3(SOURCE) M12.1(SOURCE) M12.2(SOURCE) M12.3(SOURCE) R44.2 R47.2 R48.2 R74.1 U3.20(SL) U18.3(+)
DRVB_ISENSE_VREF: R42.2 TP4.1
DRVB_ISN: C40.2 R49.1 R51.2 U3.10(ISN)
DRVB_ISP: C40.1 R42.1 R44.1 R45.1 U3.11(ISP)
DRVB_SCDL: C41.1 R43.1 R46.2 U3.18(SCDL)
MOTORB_HI: C34.1 C36.2 C43.2 C44.1 M9.1(SOURCE) M9.2(SOURCE) M9.3(SOURCE) M11.5(DRAIN) M11.6(DRAIN) M11.7(DRAIN) M11.8(DRAIN) R38.1 R53.2 U3.22(SH1) ; port MOTORB_HI
MOTORB_LO: C35.2 C37.2 C49.2 C50.2 D10.2(A) D11.1(K) M10.1(SOURCE) M10.2(SOURCE) M10.3(SOURCE) M12.5(DRAIN) M12.6(DRAIN) M12.7(DRAIN) M12.8(DRAIN) R39.2 U3.3(SH2) ; port MOTORB_LO
U3_VREG: C32.1 C33.2 U3.8(VREG)
NetC34_2: C34.2 R31.2
NetC35_1: C35.1 R32.1
NetC36_1: C36.1 U3.24(BH1)
NetC37_1: C37.1 U3.1(BH2)
NetC38_2: C38.2 R38.2
NetC39_1: C39.1 R39.1
NetC42_1: C42.1 R51.1 U3.12(ISO)
NetC57_1: C57.1 R63.1 R74.2 U18.1(OUTA) U18.2(-)
NetC58_1: C58.1 R63.2 ; port MOTORB_ISENSE
NetD7_2: D7.2(A) Q2.2(C)
NetD8_2: D8.2(A) M13.2(SOURCE)
NetD9_1: D9.1(K) M14.6(D1)
NetD9_2: D9.2(A) R52.1
NetD10_1: D10.1(K) D11.2(A) R53.1
NetD12_2: D12.2(A) R54.1
NetM8_4: M8.4(GATE) Q2.3(E) R30.2
NetM9_4: M9.4(GATE) R33.2
NetM10_4: M10.4(GATE) R34.1
NetM11_4: M11.4(GATE) R40.2
NetM12_4: M12.4(GATE) R41.1
NetM13_1: M13.1(GATE) R36.1
NetM13_3: M13.3(SOURCE) R37.1 ; port DRVB_ERR
NetM14_3: M14.3(D2) R54.2
NetQ2_1: Q2.1(B) R29.2
NetR30_1: R30.1 U3.6(RPP)
NetR35_1: R35.1 U3.5(VDH)
NetR132_2: U3.15(~{IH1}) U3.16(IL1) ; port DRVB_PWM1
NetR133_2: U3.13(~{IH2}) U3.14(IL2) ; port DRVB_PWM2

Not connected (* = marked no-connect by the designer): U18 7(OUTB)*

### Notes on the sheet
- Port Legend
- Microcontroller
- Inputs
- Connectors
- Motor A Driver
- Motor B Driver
- End Stops
- Power
- Ultrasonics
- (near R43) Firmware Note:  PWM = 800Hz
- Design Note:  Check time constant on MOSFET snubbers
- Layout Note:  Ensure Kelvin sense connection back to ISN pin
- (near R49) Gain = R51/R49 = 28V/V
  Max voltage at I_SENSE_P = 175mV
  I_Motor max = 3.5A
- (near C58) Layout Note:  Place near micro
- Error LED
- Enable LED
- (near D10) DOWN
- Drive Direction LEDs
- (near D11) UP
- Layout Note:  Place bulk capacitance as near to each half bridge as possible
- Operation Note:  These capacitors shouldn't be needed if back EMF is shorted through high side FETs

### Library data of the parts
C30 C33 = 2.2uF/35v: as C9 on sheet Motor A Driver; Value: 2.2uF
C31 C32 C34 C35 C38 C39 C41 C57 C58 = 10nF: MFG1_PN: VJ0603Y103KXAAC; MFG1: Vishay; Value: 10nF
C36 C37 = 330nF: as C15 on sheet Motor A Driver; Value: 330nF
C40 = 30pF: MFG1_PN: VJ0805A300JXBAT; MFG1: Vishay; Value: 30pF
C42 = 100pF: as C21 on sheet Motor A Driver; Value: 100pF
C43 C45 C47 C49 = 1000uF 25v: as C22 on sheet Motor A Driver; Value: 1000uF
C44 C46 C48 C50 C88 = 0.1uF: as C1 on sheet Microcontroller; Value: 0.1uF
D7 D8 = BAT43: MFG: Vishay; Value: *; MFG_PN: BAT43W-G3-18
D9 D11 = LED Green 0603: as D13 on sheet Microcontroller; MFG_PN: LTST-S270KGKT
D10 D12 = LED Red 0603: as D4 on sheet Motor A Driver; MFG_PN: VLMS1300-GS08
M8-M12 = BSC009NE2L: as M1 on sheet Motor A Driver
M13 = 2N7002: as M15 on sheet Microcontroller; P_MAX: *; RDS_ON: *; MFG_PN: 2N7002P,215
M14 = NX1029X: as M7 on sheet Motor A Driver; MFG_PN: NX1029X,115
Q2 = PBSS4021NT: as Q1 on sheet Motor A Driver; MFG_PN: PBSS4021NT,215
R29 R37 R63 = 1k (0603): as R66 on sheet Microcontroller; Value: 1k
R30 = 4k7 (0603): as R4 on sheet Motor A Driver; Value: 4k7
R31-R36 R38-R41 = 100R (0603): as R5 on sheet Motor A Driver; Value: 100R
R42 R45 = 26k7 (0603): as R16 on sheet Motor A Driver; Value: 26k7
R43 R46 = 10K (0603): as R1 on sheet Microcontroller; Value: 10k
R44 R49 = 470R (0603): as R18 on sheet Motor A Driver; Value: 470R
R47 R48 = 100mR 0.5% (2512): as R21 on sheet Motor A Driver; Value: 100m
R51 = 13k3 (0603): as R25 on sheet Motor A Driver; Value: 13k3
R52 R54 = 68R (0603): as R65 on sheet Microcontroller; Value: 68R
R53 = 604R (1206): as R27 on sheet Motor A Driver; Value: 604R
R74 = 0R (0603): MFG_PN: CRCW12060000Z0EA; MFG: Vishay; Value: 0R
TP4 = Testpoint - Via 1mm
U3 = TLE7182: as U2 on sheet Motor A Driver; MFG_PN: TLE7182EM
U18 = OPA2377AIDR: as U7 on sheet Motor A Driver; MFG_PN: OPA2377AIDR

## Sheet Connectors.SchDoc
size B; DrawnBy: Ross Harvey; Revision: A; SheetNumber: 4; ModifiedDate: 7/2/2015; ProjectName: Atlas
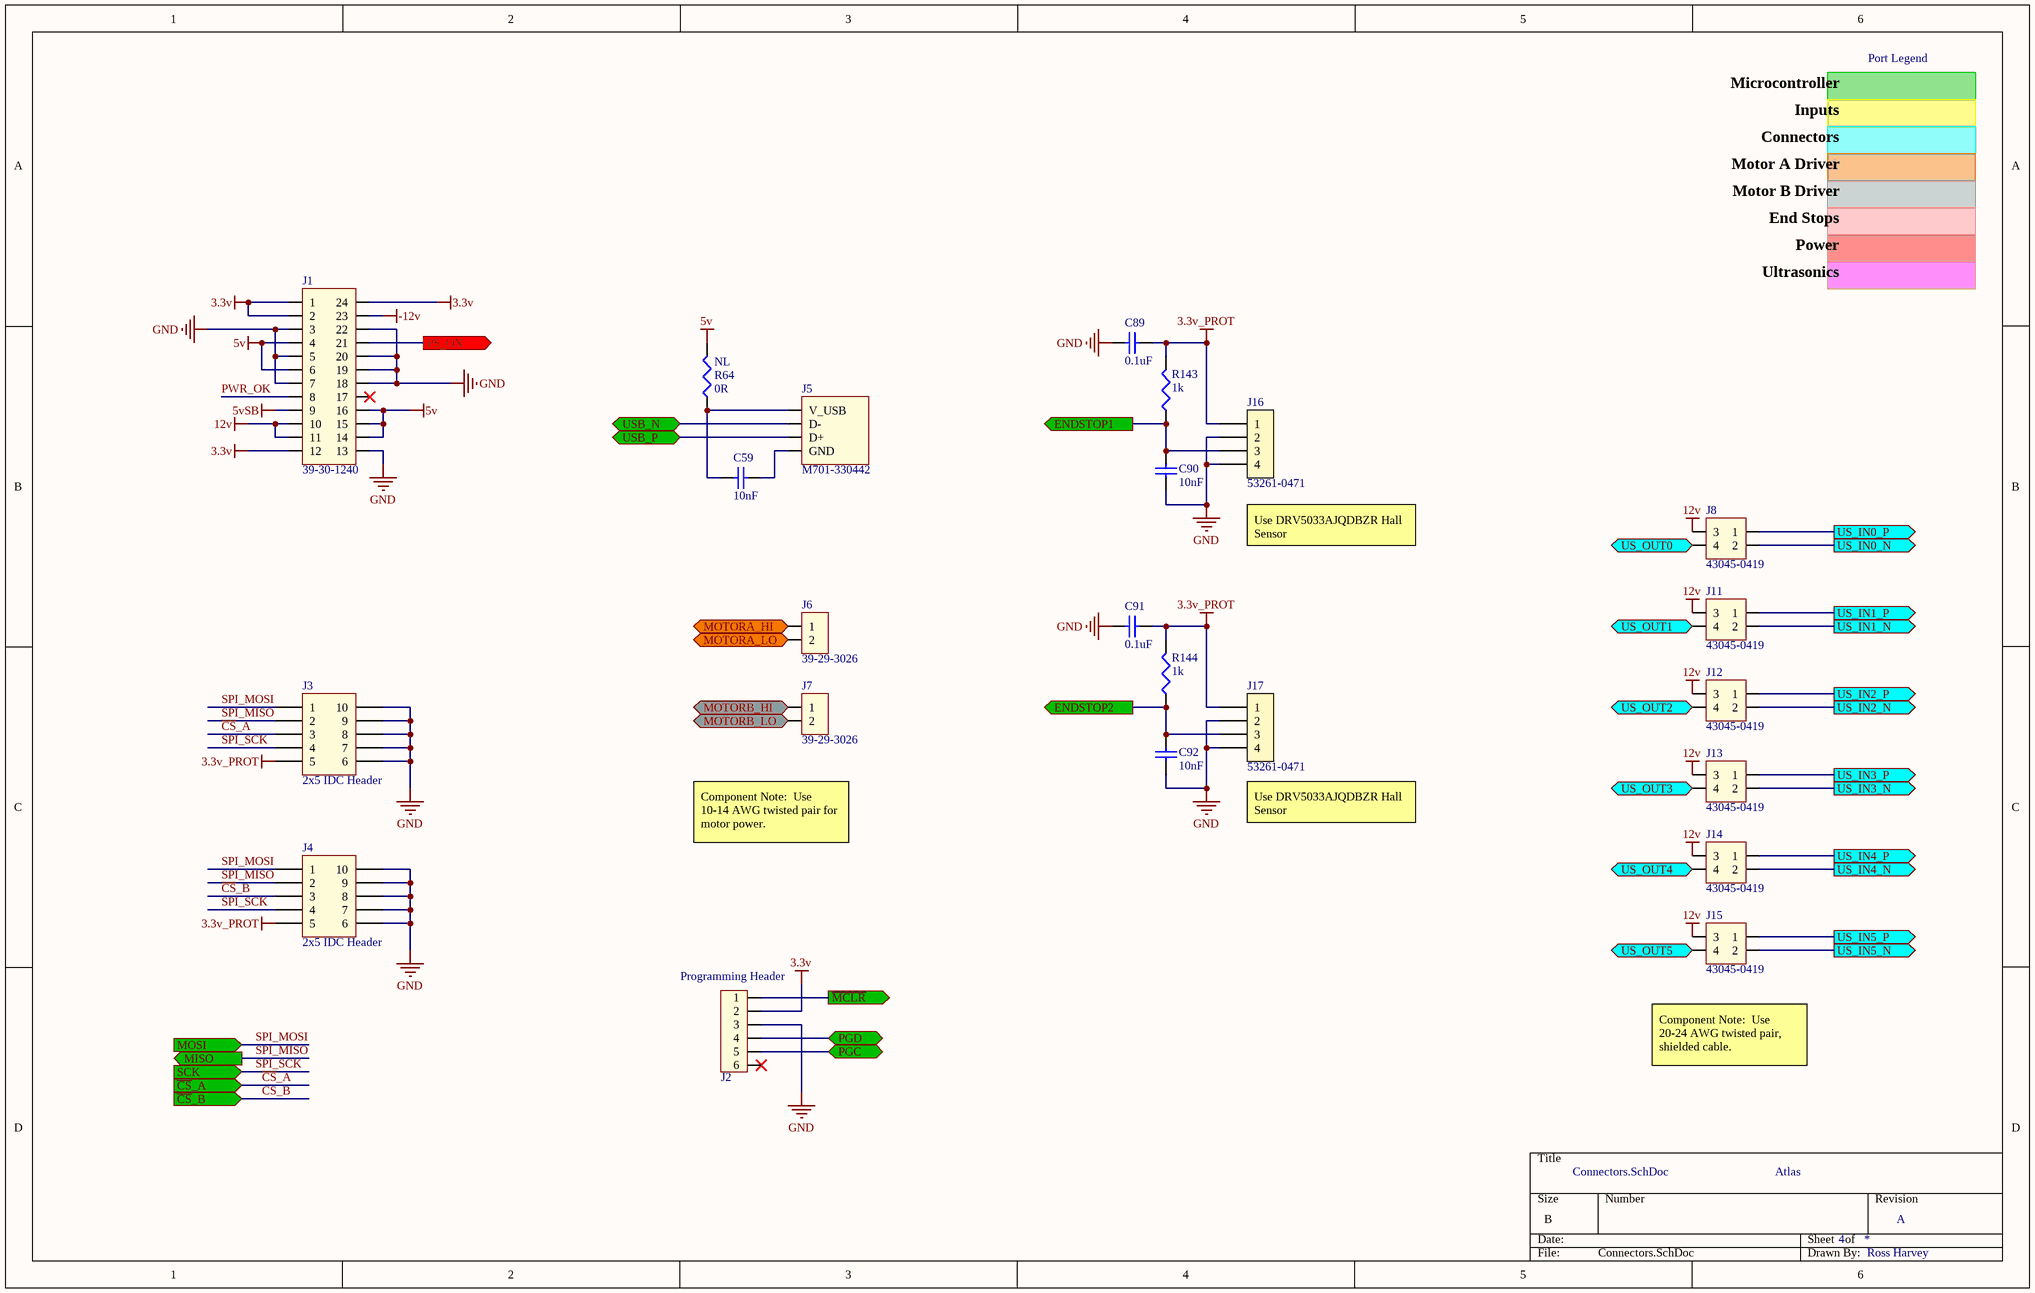
[diagram p3: Connectors.SchDoc]

### Parts
C59  10nF  [CAP0603W]
C89  0.1uF  [CAP0603W]
C90  10nF  [CAP0603W]
C91  0.1uF  [CAP0603W]
C92  10nF  [CAP0603W]
J1  39-30-1240  [MOLEX 39-30-1240]
J2  1x6 Header  [1x6 Header]  (value not drawn)
J3  87831-1010  [MOLEX_87831-1010]  (value not drawn)
J4  87831-1010  [MOLEX_87831-1010]  (value not drawn)
J5  M701-330442  [M701-330442]
J6  39-29-3026  [1x2 MicroFit]
J7  39-29-3026  [1x2 MicroFit]
J8  43045-0419  [MicroFit 2x2]
J11  43045-0419  [MicroFit 2x2]
J12  43045-0419  [MicroFit 2x2]
J13  43045-0419  [MicroFit 2x2]
J14  43045-0419  [MicroFit 2x2]
J15  43045-0419  [MicroFit 2x2]
J16  53261-0471  [1x4 PicoBlade]
J17  53261-0471  [1x4 PicoBlade]
R64  Load: NL  [RES0603W]  (hidden comment: 0R)
R143  1k  [RES0603W]
R144  1k  [RES0603W]

### Ports
ENDSTOP1 (out), ENDSTOP2 (out), MISO (out), MOSI (in), MOTORA_HI (bidir), MOTORA_LO (bidir), MOTORB_HI (bidir), MOTORB_LO (bidir), PGC (bidir), PGD (bidir), PS_ON (out), SCK (in), US_IN0_N (out), US_IN0_P (out), US_IN1_N (out), US_IN1_P (out), US_IN2_N (out), US_IN2_P (out), US_IN3_N (out), US_IN3_P (out), US_IN4_N (out), US_IN4_P (out), US_IN5_N (out), US_IN5_P (out), US_OUT0 (in), US_OUT1 (in), US_OUT2 (in), US_OUT3 (in), US_OUT4 (in), US_OUT5 (in), USB_N (bidir), USB_P (bidir), ~{CS}_A (in), ~{CS}_B (in), ~{MCLR} (out)

### Nets
3.3v: J1.1 J1.2 J1.12 J1.24 J2.2
3.3v_PROT: C89.1 C91.1 J3.5 J4.5 J16.1 J17.1 R143.2 R144.2
5v: J1.4 J1.6 J1.14 J1.15 J1.16 R64.2
5vSB: J1.9
12v: J1.10 J1.11 J8.3 J11.3 J12.3 J13.3 J14.3 J15.3
-12v: J1.23
GND: C89.2 C90.2 C91.2 C92.2 J1.3 J1.5 J1.7 J1.13 J1.18 J1.19 J1.20 J1.22 J2.3 J3.6 J3.7 J3.8 J3.9 J3.10 J4.6 J4.7 J4.8 J4.9 J4.10 J16.2 J16.4 J17.2 J17.4
~{CS}_A: J3.3 ; port ~{CS}_A
~{CS}_B: J4.3 ; port ~{CS}_B
MOTORA_HI: J6.1 ; port MOTORA_HI
MOTORA_LO: J6.2 ; port MOTORA_LO
MOTORB_HI: J7.1 ; port MOTORB_HI
MOTORB_LO: J7.2 ; port MOTORB_LO
PWR_OK: J1.8
SPI_MISO: J3.2 J4.2 ; port MISO  [project net MISO]
SPI_MOSI: J3.1 J4.1 ; port MOSI  [project net MOSI]
SPI_SCK: J3.4 J4.4 ; port SCK  [project net SCK]
US_IN0_N: J8.2 ; port US_IN0_N
US_IN0_P: J8.1 ; port US_IN0_P
US_IN1_N: J11.2 ; port US_IN1_N
US_IN1_P: J11.1 ; port US_IN1_P
US_IN2_N: J12.2 ; port US_IN2_N
US_IN2_P: J12.1 ; port US_IN2_P
US_IN3_N: J13.2 ; port US_IN3_N
US_IN3_P: J13.1 ; port US_IN3_P
US_IN4_N: J14.2 ; port US_IN4_N
US_IN4_P: J14.1 ; port US_IN4_P
US_IN5_N: J15.2 ; port US_IN5_N
US_IN5_P: J15.1 ; port US_IN5_P
USB_N: J5.2(D-) ; port USB_N
USB_P: J5.3(D+) ; port USB_P
NetC59_1: C59.1 J5.1(V_USB) R64.1
NetC59_2: C59.2 J5.4(GND)
NetC90_1: C90.1 J16.3 R143.1 ; port ENDSTOP1
NetC92_1: C92.1 J17.3 R144.1 ; port ENDSTOP2
NetJ1_21: J1.21 ; port PS_ON
NetJ2_1: J2.1 ; port ~{MCLR}
NetJ2_4: J2.4 ; port PGD
NetJ2_5: J2.5 ; port PGC
NetJ8_4: J8.4 ; port US_OUT0
NetJ11_4: J11.4 ; port US_OUT1
NetJ12_4: J12.4 ; port US_OUT2
NetJ13_4: J13.4 ; port US_OUT3
NetJ14_4: J14.4 ; port US_OUT4
NetJ15_4: J15.4 ; port US_OUT5

Not connected (* = marked no-connect by the designer): J1 17*; J2 6*

### Notes on the sheet
- Microcontroller
- Port Legend
- Inputs
- Connectors
- Motor A Driver
- Motor B Driver
- End Stops
- Power
- Ultrasonics
- (near J16) Use DRV5033AJQDBZR Hall Sensor
- Component Note:  Use 10-14 AWG twisted pair for motor power.
- (near J17) Use DRV5033AJQDBZR Hall Sensor
- (near J2) Programming Header
- Component Note:  Use 20-24 AWG twisted pair, shielded cable.

### Library data of the parts
C59 C90 C92 = 10nF: MFG1_PN: VJ0603Y103KXAAC; MFG1: Vishay; Value: 10nF
C89 C91 = 0.1uF: as C1 on sheet Microcontroller; Value: 0.1uF
J1 = Molex_39-30-1240: Male Connector for ATX Power Supply; MFG: MOLEX; CURRENT: 13A; MFG_PN: 39-30-1240
J2 = 1x6 Header: 1x6 Header, 2.52mm pitch
J3 J4 = 2x5 IDC/Ribbon Header: 2x5 IDC Header; MFG: MOLEX; ROWS: 2; POSITIONS: 10; CURRENT: 2A; MATES_WITH: 87568-1063; MFG_PN: 87831-1010; TYPE: 2x5 IDC Header
J5 = USB Vertical Connector: Board Mounted Vertical USB B-Type Plug; MFG: HARWIN; CURRENT: 4A; MFG_PN: M701-330442
J6 J7 = 1x2 Microfit: MFG: MOLEX; CURRENT: 9A; MFG_PN: 39-29-3026; MATES_WITH_HOUSING: 39-01-2020; MATES_WITH_PIN: 39-00-0038
J8 J11-J15 = 2x2 Microfit: MFG: MOLEX; CURRENT: 5A; MATES_WITH_HOUSING: 43025-0400; MFG_PN: 43045-0419; MATES_WITH_PIN: 43025-0400
J16 J17 = 1x4 PicoBlade: 1x4 PicoBlade, 1.25mm Pitch, SMD; MFG: MOLEX; LOAD: NL; I_MAX: 1A; V_MAX: 125V; MATES_WITH_HOUSING: 51021-0400; MATES_WITH_PIN: 50079-8000; MFG_PN: 53261-0471
R64 = 0R (0603): MFG_PN: CRCW12060000Z0EA; MFG: Vishay; Value: 0R
R143 R144 = 1k (0603): as R66 on sheet Microcontroller; Value: 1k

## Sheet End Stops.SchDoc
size B; DrawnBy: Ross Harvey; Revision: A; SheetNumber: 5
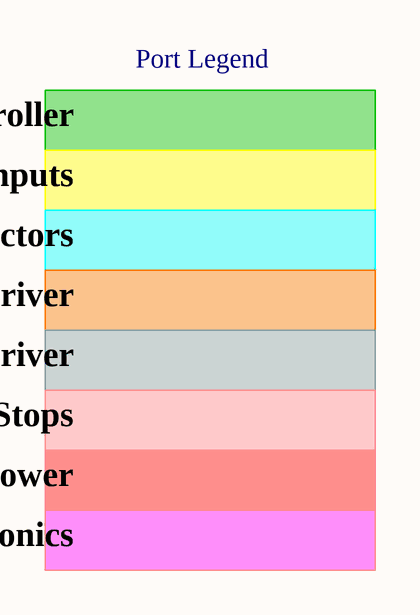
[diagram p4: End Stops.SchDoc]

### Notes on the sheet
- Microcontroller
- Port Legend
- Inputs
- Connectors
- Motor A Driver
- Motor B Driver
- End Stops
- Power
- Ultrasonics

## Sheet Power.SchDoc
size A; DrawnBy: Ross Harvey; Revision: A; SheetNumber: 6
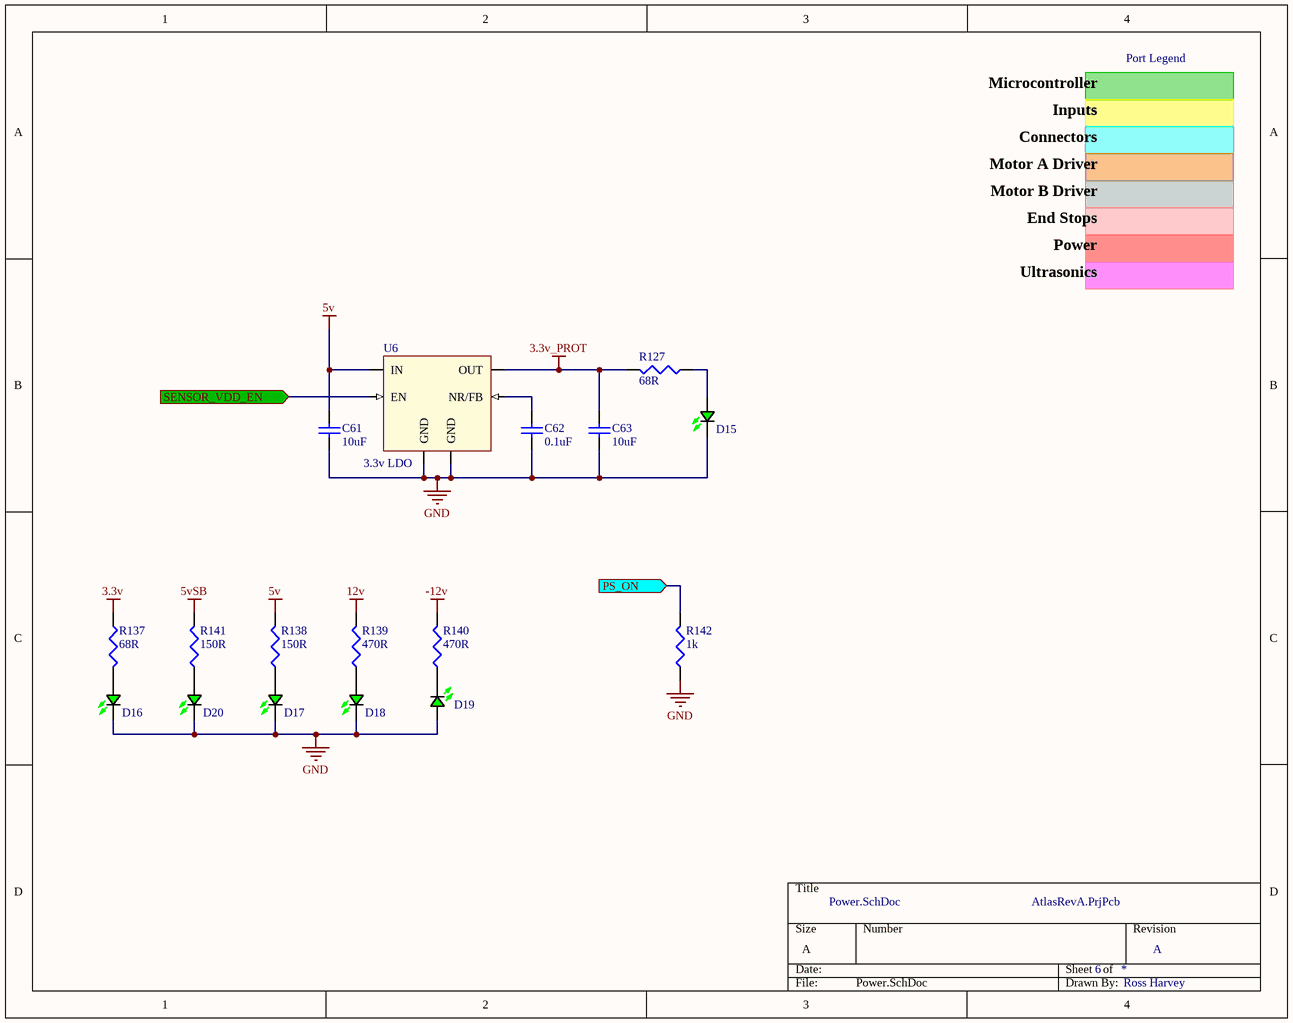
[diagram p5: Power.SchDoc]

### Parts
C61  10uF  [CAP1206R]
C62  0.1uF  [CAP0603W]
C63  10uF  [CAP1206R]
D15  LTST-S270KGKT  [LED Green 0603]  (value not drawn)
D16  LTST-S270KGKT  [LED Green 0603]  (value not drawn)
D17  LTST-S270KGKT  [LED Green 0603]  (value not drawn)
D18  LTST-S270KGKT  [LED Green 0603]  (value not drawn)
D19  LTST-S270KGKT  [LED Green 0603]  (value not drawn)
D20  LTST-S270KGKT  [LED Green 0603]  (value not drawn)
R127  68R  [RES0603W]
R137  68R  [RES0603W]
R138  150R  [RES0603W]
R139  470R  [RES0603W]
R140  470R  [RES0603W]
R141  150R  [RES0603W]
R142  1k  [RES0603W]
U6  3.3v LDO  [SOT-223-6]

### Ports
PS_ON (in), SENSOR_VDD_EN (in)

### Nets
3.3v: R137.1
3.3v_PROT: C63.2 R127.2 U6.2(OUT)
5v: C61.2 R138.2 U6.1(IN)
5vSB: R141.2
12v: R139.2
-12v: R140.2
GND: C61.1 C62.2 C63.1 D15.1(K) D16.1(K) D17.1(K) D18.1(K) D19.2(A) D20.1(K) R142.1 U6.3(GND) U6.6(GND)
NetC62_1: C62.1 U6.4(NR/FB)
NetD15_2: D15.2(A) R127.1
NetD16_2: D16.2(A) R137.2
NetD17_2: D17.2(A) R138.1
NetD18_2: D18.2(A) R139.1
NetD19_1: D19.1(K) R140.1
NetD20_2: D20.2(A) R141.1
NetJ1_21: R142.2 ; port PS_ON
NetR72_2: U6.5(EN) ; port SENSOR_VDD_EN

### Notes on the sheet
- Microcontroller
- Port Legend
- Inputs
- Connectors
- Motor A Driver
- Motor B Driver
- End Stops
- Power
- Ultrasonics

### Library data of the parts
C61 C63 = 10uF: MFG1_PN: VJ1206V106ZXQTW1BC; MFG1: Vishay; Value: 10uF
C62 = 0.1uF: as C1 on sheet Microcontroller; Value: 0.1uF
D15-D20 = LED Green 0603: as D13 on sheet Microcontroller; MFG_PN: LTST-S270KGKT
R127 R137 = 68R (0603): as R65 on sheet Microcontroller; Value: 68R
R138 R141 = 150R (0603): Tolerance: 1%; POWER: 0.1W; MFG_PN: CRCW0603150RFKEA; MFG: Vishay; Load: NL; Value: 150R
R139 R140 = 470R (0603): as R18 on sheet Motor A Driver; Value: 470R
R142 = 1k (0603): as R66 on sheet Microcontroller; Value: 1k
U6 = TPS73633DCQR: MFG: TI; MFG_PN: TPS73633DCQR; FUNCTION: 3.3v LDO

## Sheet Ultrasonics.SchDoc
size D; DrawnBy: Ross Harvey; Revision: A; SheetNumber: 7
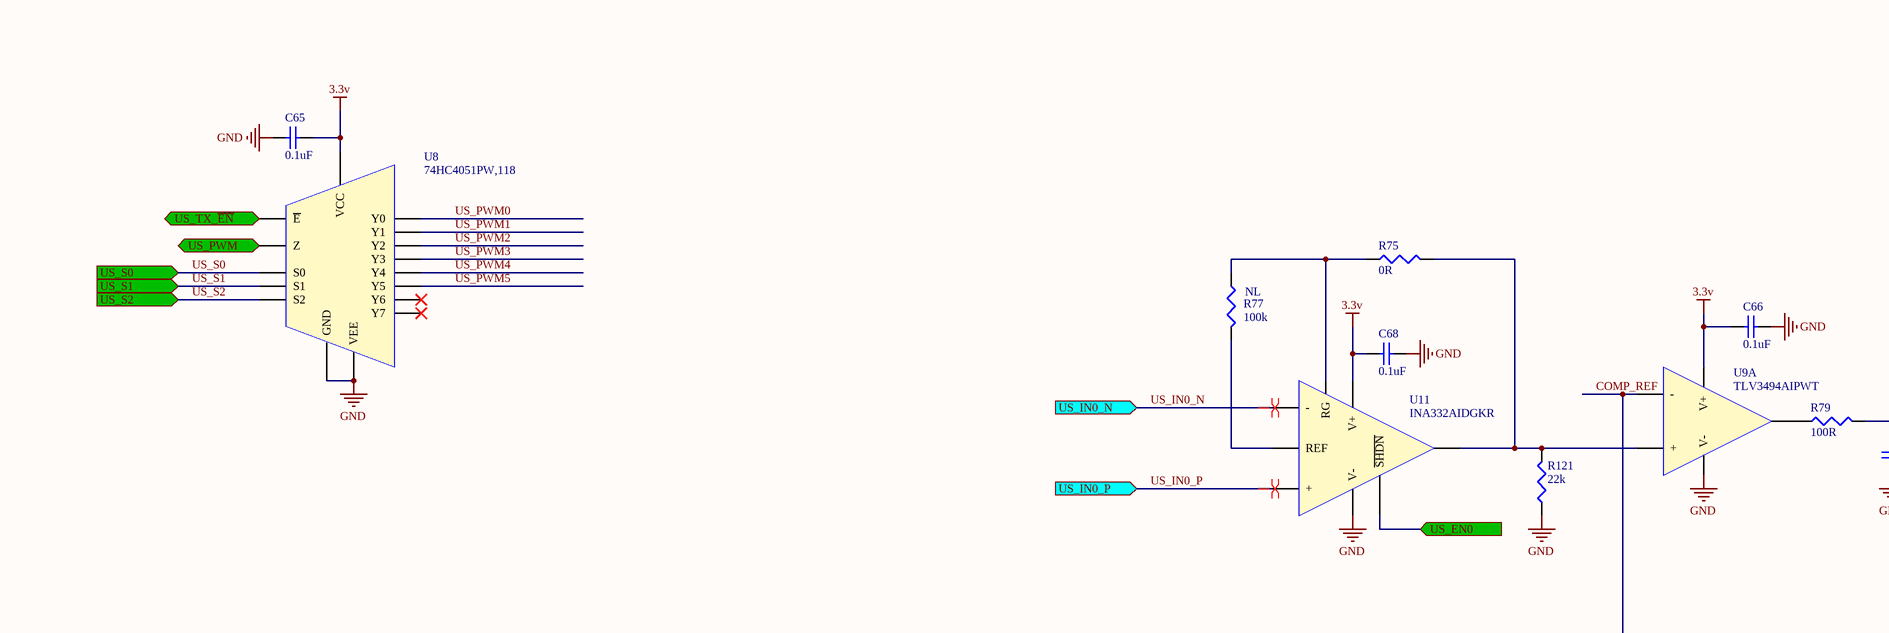
[diagram p6: Ultrasonics.SchDoc, top left]
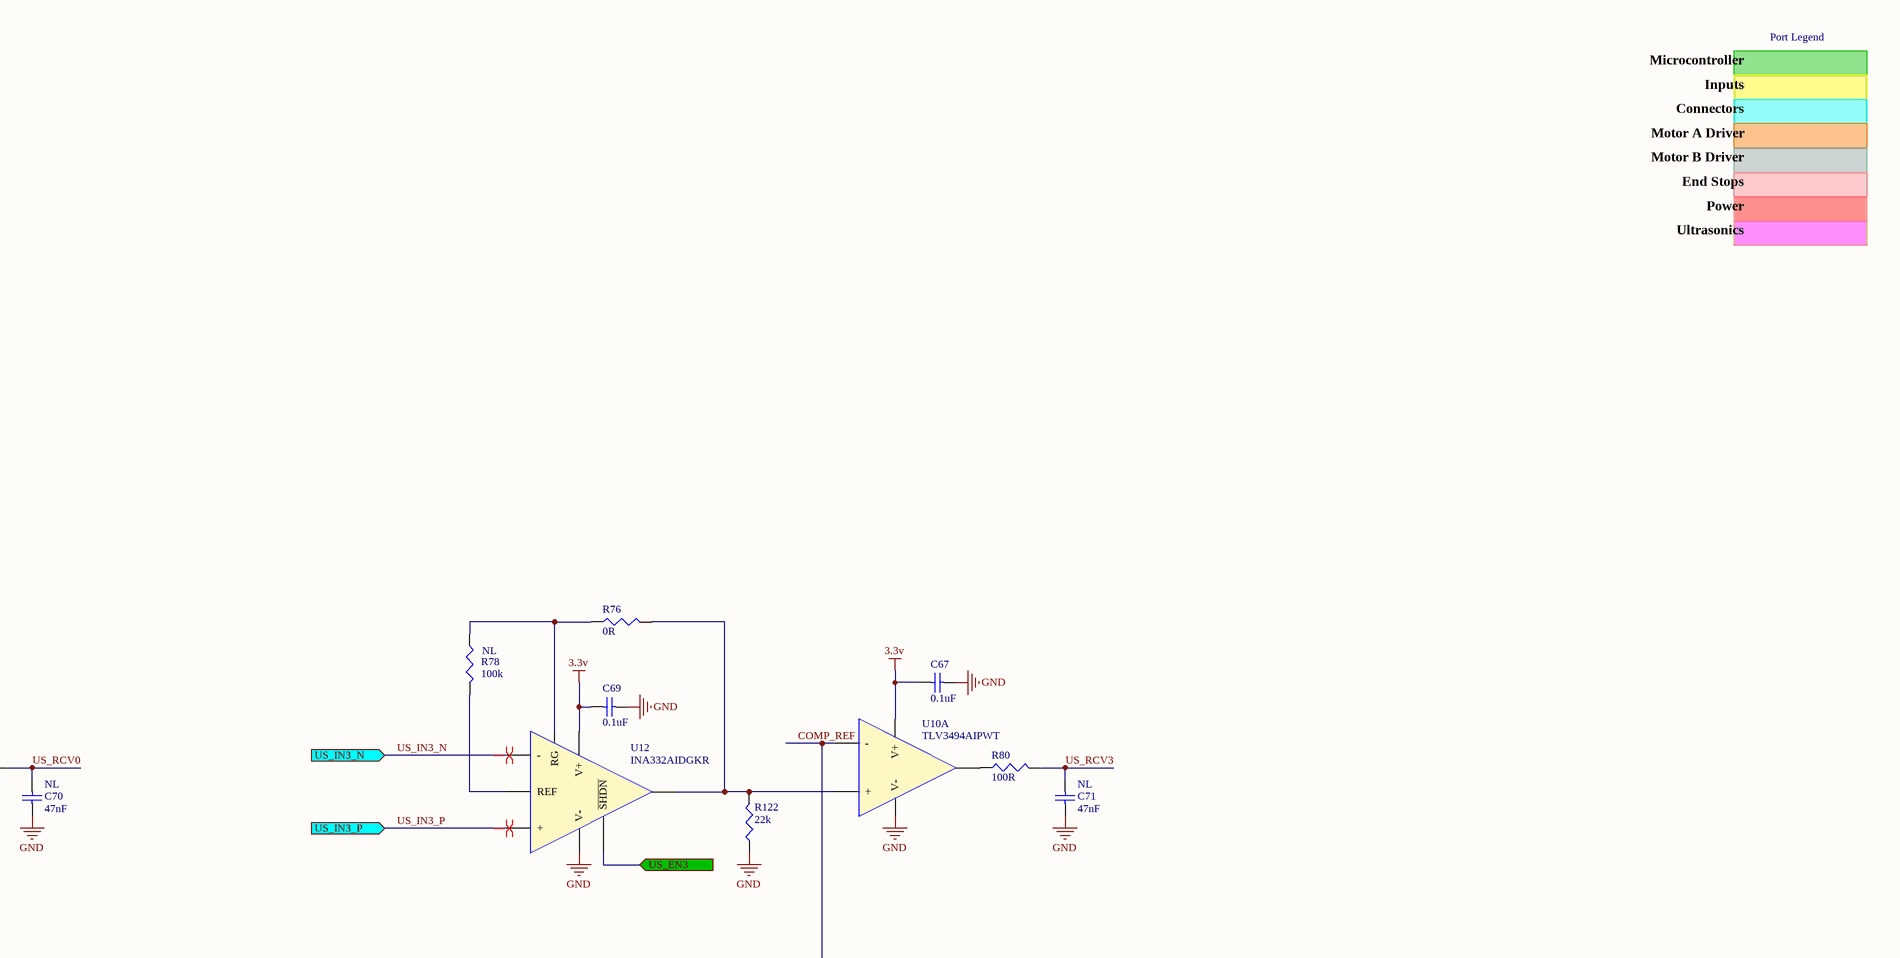
[diagram p7: Ultrasonics.SchDoc, top right]
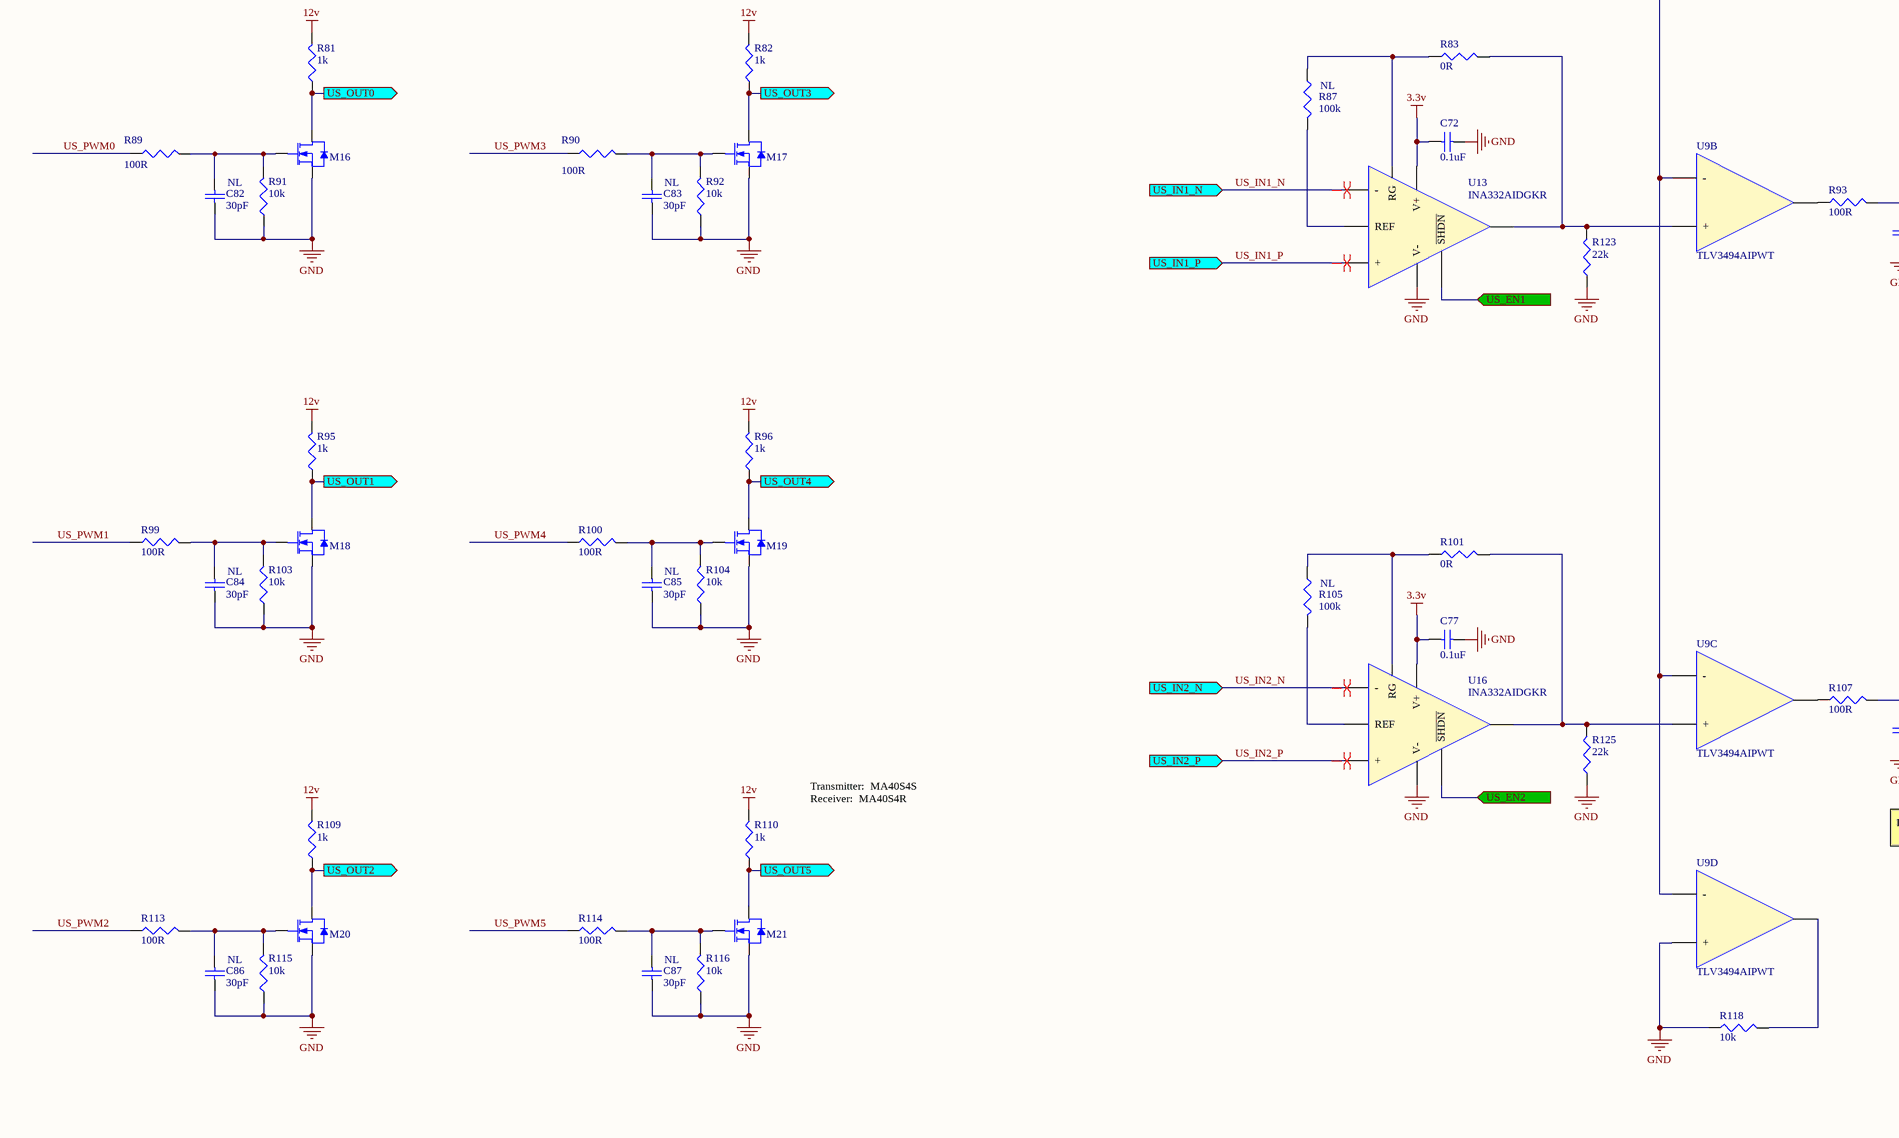
[diagram p8: Ultrasonics.SchDoc, bottom left]
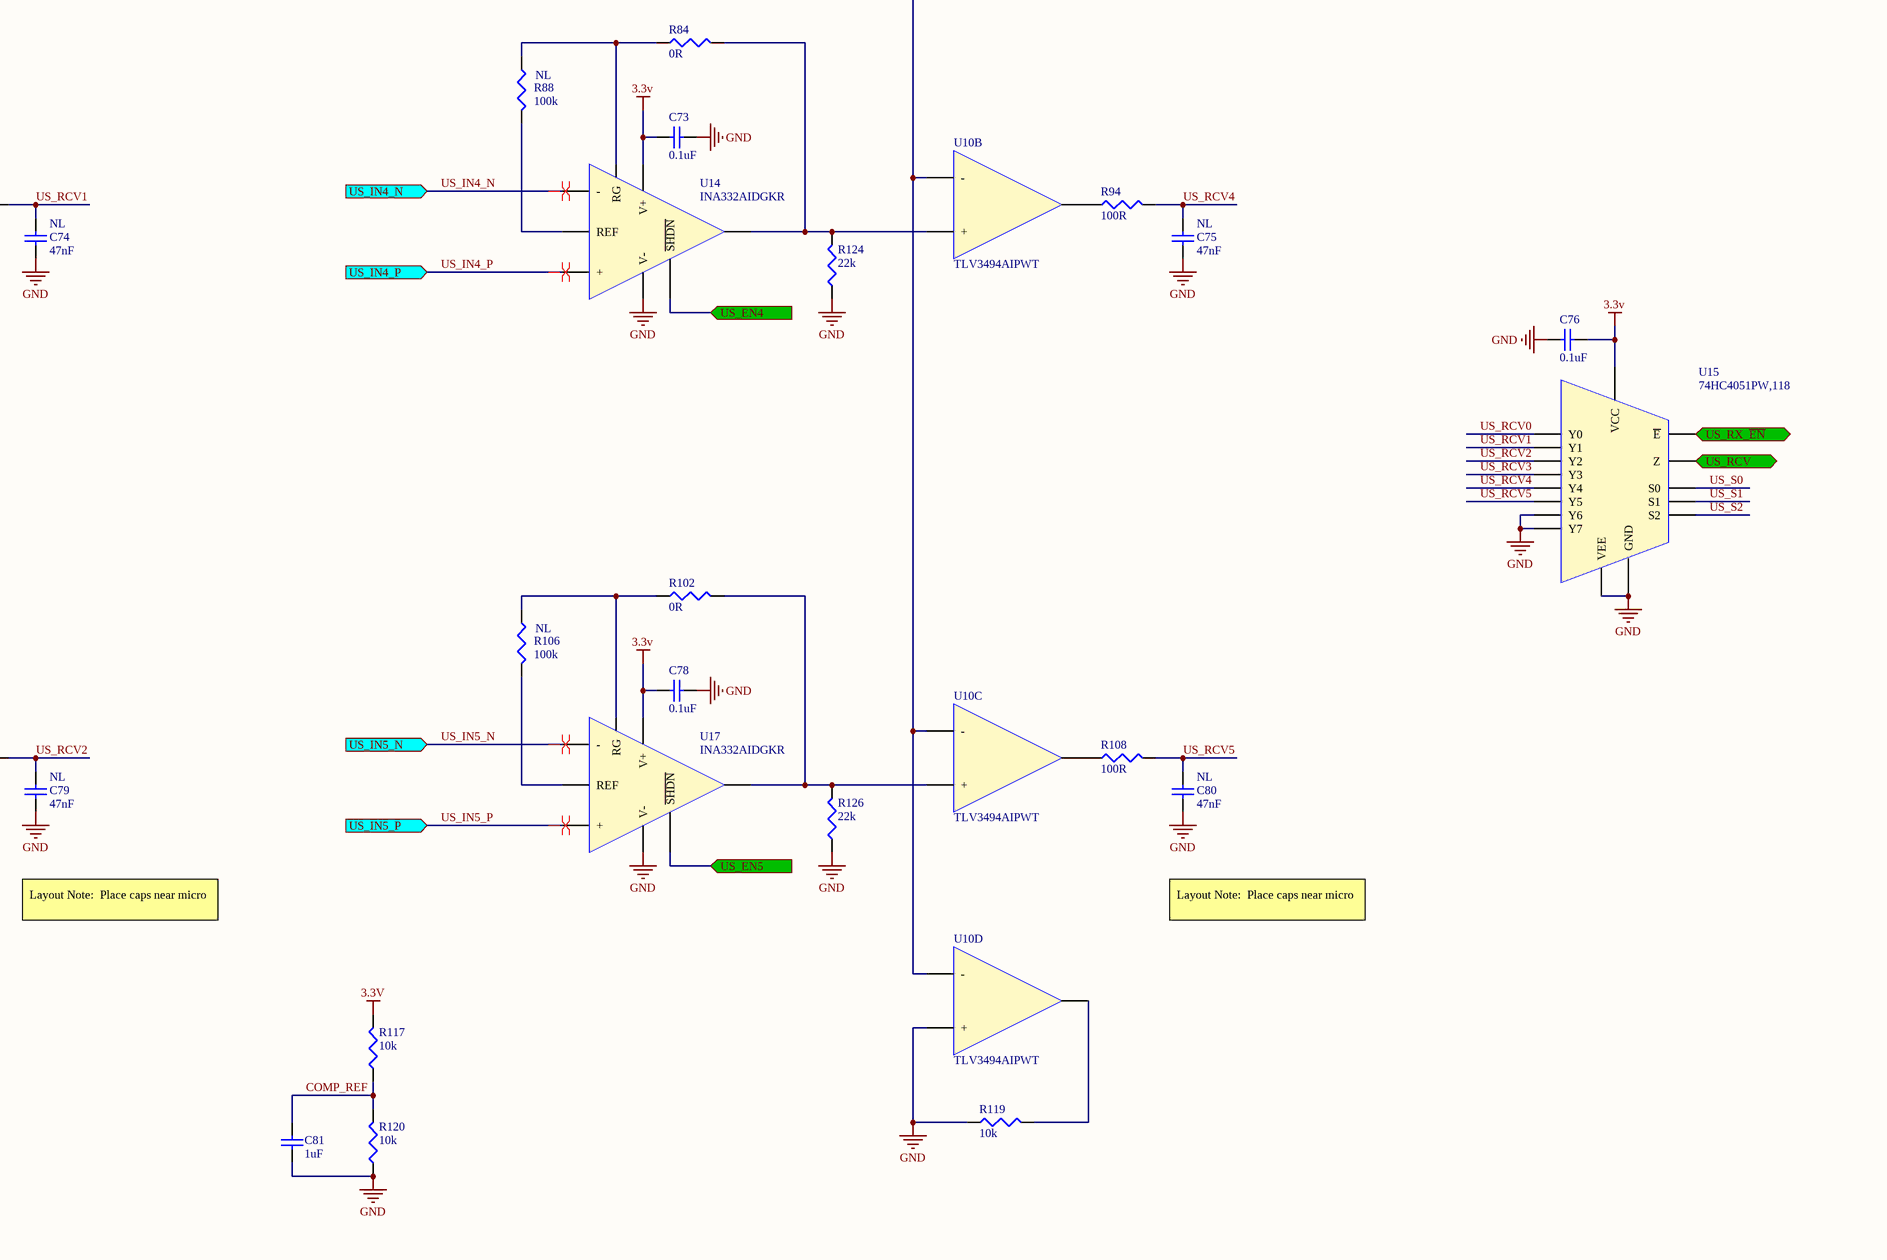
[diagram p9: Ultrasonics.SchDoc, bottom right]

### Parts
C65  0.1uF  [CAP0603W]
C66  0.1uF  [CAP0603W]
C67  0.1uF  [CAP0603W]
C68  0.1uF  [CAP0603W]
C69  0.1uF  [CAP0603W]
C70  LOAD: NL  [CAP0603W]  (hidden comment: 47nF)
C71  LOAD: NL  [CAP0603W]  (hidden comment: 47nF)
C72  0.1uF  [CAP0603W]
C73  0.1uF  [CAP0603W]
C74  LOAD: NL  [CAP0603W]  (hidden comment: 47nF)
C75  LOAD: NL  [CAP0603W]  (hidden comment: 47nF)
C76  0.1uF  [CAP0603W]
C77  0.1uF  [CAP0603W]
C78  0.1uF  [CAP0603W]
C79  LOAD: NL  [CAP0603W]  (hidden comment: 47nF)
C80  LOAD: NL  [CAP0603W]  (hidden comment: 47nF)
C81  1uF  [CAP0603W]
C82  LOAD: NL  [CAP0603W]  (hidden comment: 30pF)
C83  LOAD: NL  [CAP0603W]  (hidden comment: 30pF)
C84  LOAD: NL  [CAP0603W]  (hidden comment: 30pF)
C85  LOAD: NL  [CAP0603W]  (hidden comment: 30pF)
C86  LOAD: NL  [CAP0603W]  (hidden comment: 30pF)
C87  LOAD: NL  [CAP0603W]  (hidden comment: 30pF)
M16  Si2338DS-T1-GE3  [SOT23-3M]  (value not drawn)
M17  Si2338DS-T1-GE3  [SOT23-3M]  (value not drawn)
M18  Si2338DS-T1-GE3  [SOT23-3M]  (value not drawn)
M19  Si2338DS-T1-GE3  [SOT23-3M]  (value not drawn)
M20  Si2338DS-T1-GE3  [SOT23-3M]  (value not drawn)
M21  Si2338DS-T1-GE3  [SOT23-3M]  (value not drawn)
R75  0R  [RES0603W]
R76  0R  [RES0603W]
R77  Load: NL  [RES0603W]  (hidden comment: 100k)
R78  Load: NL  [RES0603W]  (hidden comment: 100k)
R79  100R  [RES0603W]
R80  100R  [RES0603W]
R81  1k  [RES0603W]
R82  1k  [RES0603W]
R83  0R  [RES0603W]
R84  0R  [RES0603W]
R87  Load: NL  [RES0603W]  (hidden comment: 100k)
R88  Load: NL  [RES0603W]  (hidden comment: 100k)
R89  100R  [RES0603W]
R90  100R  [RES0603W]
R91  10k  [RES0603W]
R92  10k  [RES0603W]
R93  100R  [RES0603W]
R94  100R  [RES0603W]
R95  1k  [RES0603W]
R96  1k  [RES0603W]
R99  100R  [RES0603W]
R100  100R  [RES0603W]
R101  0R  [RES0603W]
R102  0R  [RES0603W]
R103  10k  [RES0603W]
R104  10k  [RES0603W]
R105  Load: NL  [RES0603W]  (hidden comment: 100k)
R106  Load: NL  [RES0603W]  (hidden comment: 100k)
R107  100R  [RES0603W]
R108  100R  [RES0603W]
R109  1k  [RES0603W]
R110  1k  [RES0603W]
R113  100R  [RES0603W]
R114  100R  [RES0603W]
R115  10k  [RES0603W]
R116  10k  [RES0603W]
R117  10k  [RES0603W]
R118  10k  [RES0603W]
R119  10k  [RES0603W]
R120  10k  [RES0603W]
R121  22k  [RES0603W]
R122  22k  [RES0603W]
R123  22k  [RES0603W]
R124  22k  [RES0603W]
R125  22k  [RES0603W]
R126  22k  [RES0603W]
U8  74HC4051PW,118  [TSSOP16]
U9  TLV3494AIPWT  [TSSOP14]  (parts A,B,C,D of 4)
U10  TLV3494AIPWT  [TSSOP14]  (parts A,B,C,D of 4)
U11  INA332AIDGKR  [VSSOP8]
U12  INA332AIDGKR  [VSSOP8]
U13  INA332AIDGKR  [VSSOP8]
U14  INA332AIDGKR  [VSSOP8]
U15  74HC4051PW,118  [TSSOP16]
U16  INA332AIDGKR  [VSSOP8]
U17  INA332AIDGKR  [VSSOP8]

### Ports
US_EN0 (in), US_EN1 (in), US_EN2 (in), US_EN3 (in), US_EN4 (in), US_EN5 (in), US_IN0_N (in), US_IN0_P (in), US_IN1_N (in), US_IN1_P (in), US_IN2_N (in), US_IN2_P (in), US_IN3_N (in), US_IN3_P (in), US_IN4_N (in), US_IN4_P (in), US_IN5_N (in), US_IN5_P (in), US_OUT0 (out), US_OUT1 (out), US_OUT2 (out), US_OUT3 (out), US_OUT4 (out), US_OUT5 (out), US_PWM (in), US_RCV (out), US_RX_~{EN} (in), US_S0 (in), US_S1 (in), US_S2 (in), US_TX_~{EN} (in)

### Nets
3.3v: C65.2 C66.1 C67.1 C68.1 C69.1 C72.1 C73.1 C76.2 C77.1 C78.1 R117.2 U8.16(VCC) U9.4(V+) U10.4(V+) U11.7(V+) U12.7(V+) U13.7(V+) U14.7(V+) U15.16(VCC) U16.7(V+) U17.7(V+)
12v: R81.2 R82.2 R95.2 R96.2 R109.2 R110.2
GND: C65.1 C66.2 C67.2 C68.2 C69.2 C70.2 C71.2 C72.2 C73.2 C74.2 C75.2 C76.1 C77.2 C78.2 C79.2 C80.2 C81.2 C82.2 C83.2 C84.2 C85.2 C86.2 C87.2 M16.2(SOURCE) M17.2(SOURCE) M18.2(SOURCE) M19.2(SOURCE) M20.2(SOURCE) M21.2(SOURCE) R91.1 R92.1 R103.1 R104.1 R115.1 R116.1 R118.1 R119.1 R120.1 R121.1 R122.1 R123.1 R124.1 R125.1 R126.1 U8.7(VEE) U8.8(GND) U9.11(V-) U9.12(+) U10.11(V-) U10.12(+) U11.4(V-) U12.4(V-) U13.4(V-) U14.4(V-) U15.2(Y6) U15.4(Y7) U15.7(VEE) U15.8(GND) U16.4(V-) U17.4(V-)
COMP_REF: C81.1 R117.1 R120.2 U9.2(-) U9.6(-) U9.9(-) U9.13(-) U10.2(-) U10.6(-) U10.9(-) U10.13(-)
US_IN0_N: U11.2(-) ; port US_IN0_N
US_IN0_P: U11.3(+) ; port US_IN0_P
US_IN1_N: U13.2(-) ; port US_IN1_N
US_IN1_P: U13.3(+) ; port US_IN1_P
US_IN2_N: U16.2(-) ; port US_IN2_N
US_IN2_P: U16.3(+) ; port US_IN2_P
US_IN3_N: U12.2(-) ; port US_IN3_N
US_IN3_P: U12.3(+) ; port US_IN3_P
US_IN4_N: U14.2(-) ; port US_IN4_N
US_IN4_P: U14.3(+) ; port US_IN4_P
US_IN5_N: U17.2(-) ; port US_IN5_N
US_IN5_P: U17.3(+) ; port US_IN5_P
US_PWM0: R89.1 U8.13(Y0)
US_PWM1: R99.1 U8.14(Y1)
US_PWM2: R113.1 U8.15(Y2)
US_PWM3: R90.1 U8.12(Y3)
US_PWM4: R100.1 U8.1(Y4)
US_PWM5: R114.1 U8.5(Y5)
US_RCV0: C70.1 R79.2 U15.13(Y0)
US_RCV1: C74.1 R93.2 U15.14(Y1)
US_RCV2: C79.1 R107.2 U15.15(Y2)
US_RCV3: C71.1 R80.2 U15.12(Y3)
US_RCV4: C75.1 R94.2 U15.1(Y4)
US_RCV5: C80.1 R108.2 U15.5(Y5)
US_S0: U8.11(S0) U15.11(S0) ; port US_S0
US_S1: U8.10(S1) U15.10(S1) ; port US_S1
US_S2: U8.9(S2) U15.9(S2) ; port US_S2
NetC82_1: C82.1 M16.1(GATE) R89.2 R91.2
NetC83_1: C83.1 M17.1(GATE) R90.2 R92.2
NetC84_1: C84.1 M18.1(GATE) R99.2 R103.2
NetC85_1: C85.1 M19.1(GATE) R100.2 R104.2
NetC86_1: C86.1 M20.1(GATE) R113.2 R115.2
NetC87_1: C87.1 M21.1(GATE) R114.2 R116.2
NetJ8_4: M16.3(SOURCE) R81.1 ; port US_OUT0
NetJ11_4: M18.3(SOURCE) R95.1 ; port US_OUT1
NetJ12_4: M20.3(SOURCE) R109.1 ; port US_OUT2
NetJ13_4: M17.3(SOURCE) R82.1 ; port US_OUT3
NetJ14_4: M19.3(SOURCE) R96.1 ; port US_OUT4
NetJ15_4: M21.3(SOURCE) R110.1 ; port US_OUT5
NetR75_1: R75.1 R77.1 U11.1(RG)
NetR75_2: R75.2 R121.2 U9.3(+) U11.6(OUT)
NetR76_1: R76.1 R78.1 U12.1(RG)
NetR76_2: R76.2 R122.2 U10.3(+) U12.6(OUT)
NetR77_2: R77.2 U11.5(REF)
NetR78_2: R78.2 U12.5(REF)
NetR79_1: R79.1 U9.1(OUTA)
NetR80_1: R80.1 U10.1(OUTA)
NetR83_1: R83.1 R87.1 U13.1(RG)
NetR83_2: R83.2 R123.2 U9.5(+) U13.6(OUT)
NetR84_1: R84.1 R88.1 U14.1(RG)
NetR84_2: R84.2 R124.2 U10.5(+) U14.6(OUT)
NetR86_1: U15.6(~{E}) ; port US_RX_~{EN}
NetR87_2: R87.2 U13.5(REF)
NetR88_2: R88.2 U14.5(REF)
NetR93_1: R93.1 U9.12(OUTB)
NetR94_1: R94.1 U10.12(OUTB)
NetR97_1: U8.6(~{E}) ; port US_TX_~{EN}
NetR98_1: U11.8(~{SHDN}) ; port US_EN0
NetR101_1: R101.1 R105.1 U16.1(RG)
NetR101_2: R101.2 R125.2 U9.10(+) U16.6(OUT)
NetR102_1: R102.1 R106.1 U17.1(RG)
NetR102_2: R102.2 R126.2 U10.10(+) U17.6(OUT)
NetR105_2: R105.2 U16.5(REF)
NetR106_2: R106.2 U17.5(REF)
NetR107_1: R107.1 U9.8(OUTC)
NetR108_1: R108.1 U10.8(OUTC)
NetR111_1: U13.8(~{SHDN}) ; port US_EN1
NetR112_1: U16.8(~{SHDN}) ; port US_EN2
NetR118_2: R118.2 U9.14(OUTD)
NetR119_2: R119.2 U10.14(OUTD)
NetR129_1: U12.8(~{SHDN}) ; port US_EN3
NetR130_1: U14.8(~{SHDN}) ; port US_EN4
NetR131_1: U17.8(~{SHDN}) ; port US_EN5
NetR136_2: U8.3(Z) ; port US_PWM
NetU1_19: U15.3(Z) ; port US_RCV

Not connected (* = marked no-connect by the designer): U8 2(Y6)* 4(Y7)*

### Layout directives
differential pair: US_IN0_N, US_IN0_P, US_IN1_N, US_IN1_P, US_IN2_N, US_IN2_P, US_IN3_N, US_IN3_P, US_IN4_N, US_IN4_P, US_IN5_N, US_IN5_P

### Notes on the sheet
- Port Legend
- Microcontroller
- Inputs
- Connectors
- Motor A Driver
- Motor B Driver
- End Stops
- Power
- Ultrasonics
- Transmitter:  MA40S4S
  Receiver:  MA40S4R
- Layout Note:  Place caps near micro

### Library data of the parts
C65-C69 C72 C73 C76-C78 = 0.1uF: as C1 on sheet Microcontroller; Value: 0.1uF
C70 C71 C74 C75 C79 C80 = 47nF: MFG1_PN: VJ0603Y473JXQPW1BC; MFG1: Vishay; Value: 47nF
C81 = 1uF: MFG1_PN: VJ0805V105ZXXTW1BC; MFG1: Vishay; Value: 1uF
C82-C87 = 30pF: MFG1_PN: VJ0805A300JXBAT; MFG1: Vishay; Value: 30pF
M16-M21 = Si2338DS: NFET_SINGLE_6A_30V; LOAD: NL; MFG: VISHAY; VDS_MAX: 30v; I_MAX: 6A; VGS_MAX: 20v; P_MAX: *; RDS_ON: *; MFG_PN: Si2338DS-T1-GE3
R75 R76 R83 R84 R101 R102 = 0R (0603): MFG_PN: CRCW12060000Z0EA; MFG: Vishay; Load: NL; Value: 0R
R77 R78 R87 R88 R105 R106 = 100k (0603): Tolerance: 1%; POWER: 0.1W; MFG1_PN: CRCW0603100KFKEA; MFG1: Vishay; Value: 100k
R79 R80 R89 R90 R93 R94 R99 R100 R107 R108 R113 R114 = 100R (0603): as R5 on sheet Motor A Driver; Value: 100R
R81 R82 R95 R96 R109 R110 = 1k (0603): as R66 on sheet Microcontroller; Value: 1k
R91 R92 R103 R104 R115-R120 = 10K (0603): as R1 on sheet Microcontroller; Value: 10k
R121-R126 = 22k (0603): Tolerance: 1%; POWER: 0.1W; MFG_PN: CRCW060322K0FKEA; MFG: Vishay; Load: NL; Value: 22k
U8 U15 = 74HC4051PW: 8:1 MUX/DEMUX; LOAD: NL; MFG: NXP; BANDWIDTH: 180MHz; MFG_PN: 74HC4051PW,118
U9 U10 = TLV3494AIPWT: Quad Comparator - Push-Pull Output; MFG: TI; CHANNELS: 4; LOAD: NL; VMAX: 5.5v; MFG_PN: TLV3494AIPWT
U11-U14 U16 U17 = INA332AIDGKR: Instrumentation Amplifier - 1 Channel; MFG: TI; LOAD: NL; GBP: 2MHz; VMAX: 5.5v; SINGLE_SUPPLY: TRUE; MFG_PN: INA332AIDGKR

## Sheet Project Overview.SchDoc
size B
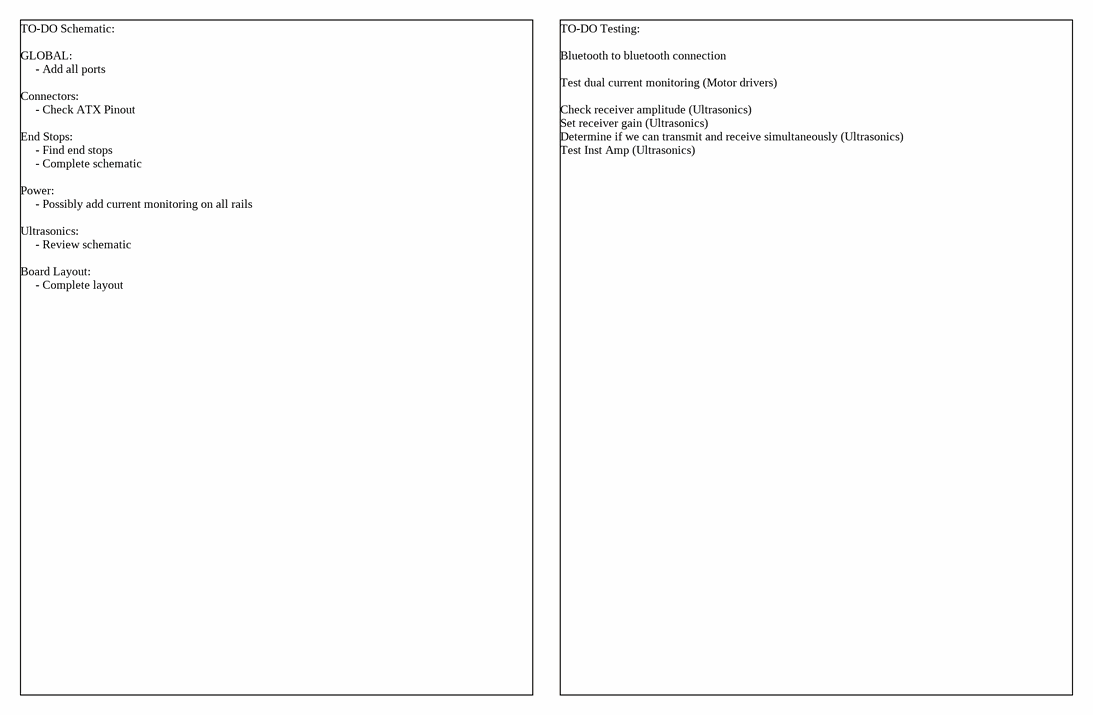
[diagram p10: Project Overview.SchDoc]

### Notes on the sheet
- TO-DO Schematic:
  GLOBAL:
  - Add all ports
  Connectors:
  - Check ATX Pinout
  End Stops:
  - Find end stops
  - Complete schematic
  Power:
  - Possibly add current monitoring on all rails
  Ultrasonics:
  - Review schematic
  Board Layout:
  - Complete layout
- TO-DO Testing:
  Bluetooth to bluetooth connection
  Test dual current monitoring (Motor drivers)
  Check receiver amplitude (Ultrasonics)
  Set receiver gain (Ultrasonics)
  Determine if we can transmit and receive simultaneously (Ultrasonics)
  Test Inst Amp (Ultrasonics)

## Nets that join several sheets
3.3v: Microcontroller (24 pins), Motor A Driver (7 pins), Motor B Driver (7 pins), Connectors (5 pins), Power (R137.1), Ultrasonics (21 pins)
3.3v_PROT: Connectors (8 pins), Power (C63.2 R127.2 U6.2)
5v: Microcontroller (C53.1 C54.1 R60.2 U4.20), Motor A Driver (R17.2), Motor B Driver (R43.2), Connectors (6 pins), Power (C61.2 R138.2 U6.1)
5vSB: Connectors (J1.9), Power (R141.2)
12v: Motor A Driver (7 pins), Motor B Driver (7 pins), Connectors (8 pins), Power (R139.2), Ultrasonics (6 pins)
-12v: Connectors (J1.23), Power (R140.2)
GND: Microcontroller (36 pins), Motor A Driver (29 pins), Motor B Driver (29 pins), Connectors (27 pins), Power (12 pins), Ultrasonics (60 pins)
~{CS}_A: Microcontroller (J9.6 U1.49), Connectors (J3.3)
~{CS}_B: Microcontroller (J9.7 U1.55), Connectors (J4.3)
DRVA_EN: Microcontroller (R55.2), Motor A Driver (M7.2 U2.9)
DRVB_EN: Microcontroller (R56.1), Motor B Driver (M14.2 U3.9)
MISO: Microcontroller (J9.4 U1.51 U5.24), Connectors (J3.2 J4.2)
MOSI: Microcontroller (J9.3 U1.52 U5.2), Connectors (J3.1 J4.1)
MOTORA_HI: Motor A Driver (12 pins), Connectors (J6.1)
MOTORA_LO: Motor A Driver (13 pins), Connectors (J6.2)
MOTORB_HI: Motor B Driver (14 pins), Connectors (J7.1)
MOTORB_LO: Motor B Driver (15 pins), Connectors (J7.2)
NetC56_1: Microcontroller (U1.23), Motor A Driver (C56.1 R62.2)
NetC58_1: Microcontroller (U1.22), Motor B Driver (C58.1 R63.2)
NetC90_1: Microcontroller (U1.77), Connectors (C90.1 J16.3 R143.1)
NetC92_1: Microcontroller (U1.78), Connectors (C92.1 J17.3 R144.1)
NetJ1_21: Connectors (J1.21), Power (R142.2)
NetJ2_1: Microcontroller (R1.1 R2.1 S1.3 S1.4), Connectors (J2.1)
NetJ2_4: Microcontroller (U1.25), Connectors (J2.4)
NetJ2_5: Microcontroller (U1.24), Connectors (J2.5)
NetJ8_4: Connectors (J8.4), Ultrasonics (M16.3 R81.1)
NetJ11_4: Connectors (J11.4), Ultrasonics (M18.3 R95.1)
NetJ12_4: Connectors (J12.4), Ultrasonics (M20.3 R109.1)
NetJ13_4: Connectors (J13.4), Ultrasonics (M17.3 R82.1)
NetJ14_4: Connectors (J14.4), Ultrasonics (M19.3 R96.1)
NetJ15_4: Connectors (J15.4), Ultrasonics (M21.3 R110.1)
NetM6_3: Microcontroller (U1.56), Motor A Driver (M6.3 R11.1)
NetM13_3: Microcontroller (U1.7), Motor B Driver (M13.3 R37.1)
NetR72_2: Microcontroller (R72.2), Power (U6.5)
NetR86_1: Microcontroller (R86.1), Ultrasonics (U15.6)
NetR97_1: Microcontroller (R97.1), Ultrasonics (U8.6)
NetR98_1: Microcontroller (R98.1), Ultrasonics (U11.8)
NetR111_1: Microcontroller (R111.1), Ultrasonics (U13.8)
NetR112_1: Microcontroller (R112.1), Ultrasonics (U16.8)
NetR129_1: Microcontroller (R129.1), Ultrasonics (U12.8)
NetR130_1: Microcontroller (R130.1), Ultrasonics (U14.8)
NetR131_1: Microcontroller (R131.1), Ultrasonics (U17.8)
NetR132_2: Microcontroller (R132.2), Motor B Driver (U3.15 U3.16)
NetR133_2: Microcontroller (R133.2), Motor B Driver (U3.13 U3.14)
NetR134_2: Microcontroller (R134.2), Motor A Driver (U2.15 U2.16)
NetR135_2: Microcontroller (R135.2), Motor A Driver (U2.13 U2.14)
NetR136_2: Microcontroller (R136.2), Ultrasonics (U8.3)
NetU1_19: Microcontroller (U1.19), Ultrasonics (U15.3)
SCK: Microcontroller (J9.5 U1.50 U5.6), Connectors (J3.4 J4.4)
US_IN0_N: Connectors (J8.2), Ultrasonics (U11.2)
US_IN0_P: Connectors (J8.1), Ultrasonics (U11.3)
US_IN1_N: Connectors (J11.2), Ultrasonics (U13.2)
US_IN1_P: Connectors (J11.1), Ultrasonics (U13.3)
US_IN2_N: Connectors (J12.2), Ultrasonics (U16.2)
US_IN2_P: Connectors (J12.1), Ultrasonics (U16.3)
US_IN3_N: Connectors (J13.2), Ultrasonics (U12.2)
US_IN3_P: Connectors (J13.1), Ultrasonics (U12.3)
US_IN4_N: Connectors (J14.2), Ultrasonics (U14.2)
US_IN4_P: Connectors (J14.1), Ultrasonics (U14.3)
US_IN5_N: Connectors (J15.2), Ultrasonics (U17.2)
US_IN5_P: Connectors (J15.1), Ultrasonics (U17.3)
US_S0: Microcontroller (R24.1), Ultrasonics (U8.11 U15.11)
US_S1: Microcontroller (R50.1), Ultrasonics (U8.10 U15.10)
US_S2: Microcontroller (R85.1), Ultrasonics (U8.9 U15.9)
USB_N: Microcontroller (U4.16), Connectors (J5.2)
USB_P: Microcontroller (U4.15), Connectors (J5.3)